# EAGLE schematic BeagleBone_Black_egl (EAGLE 6.2), part 1 of 2

## Sheet 1 of 11
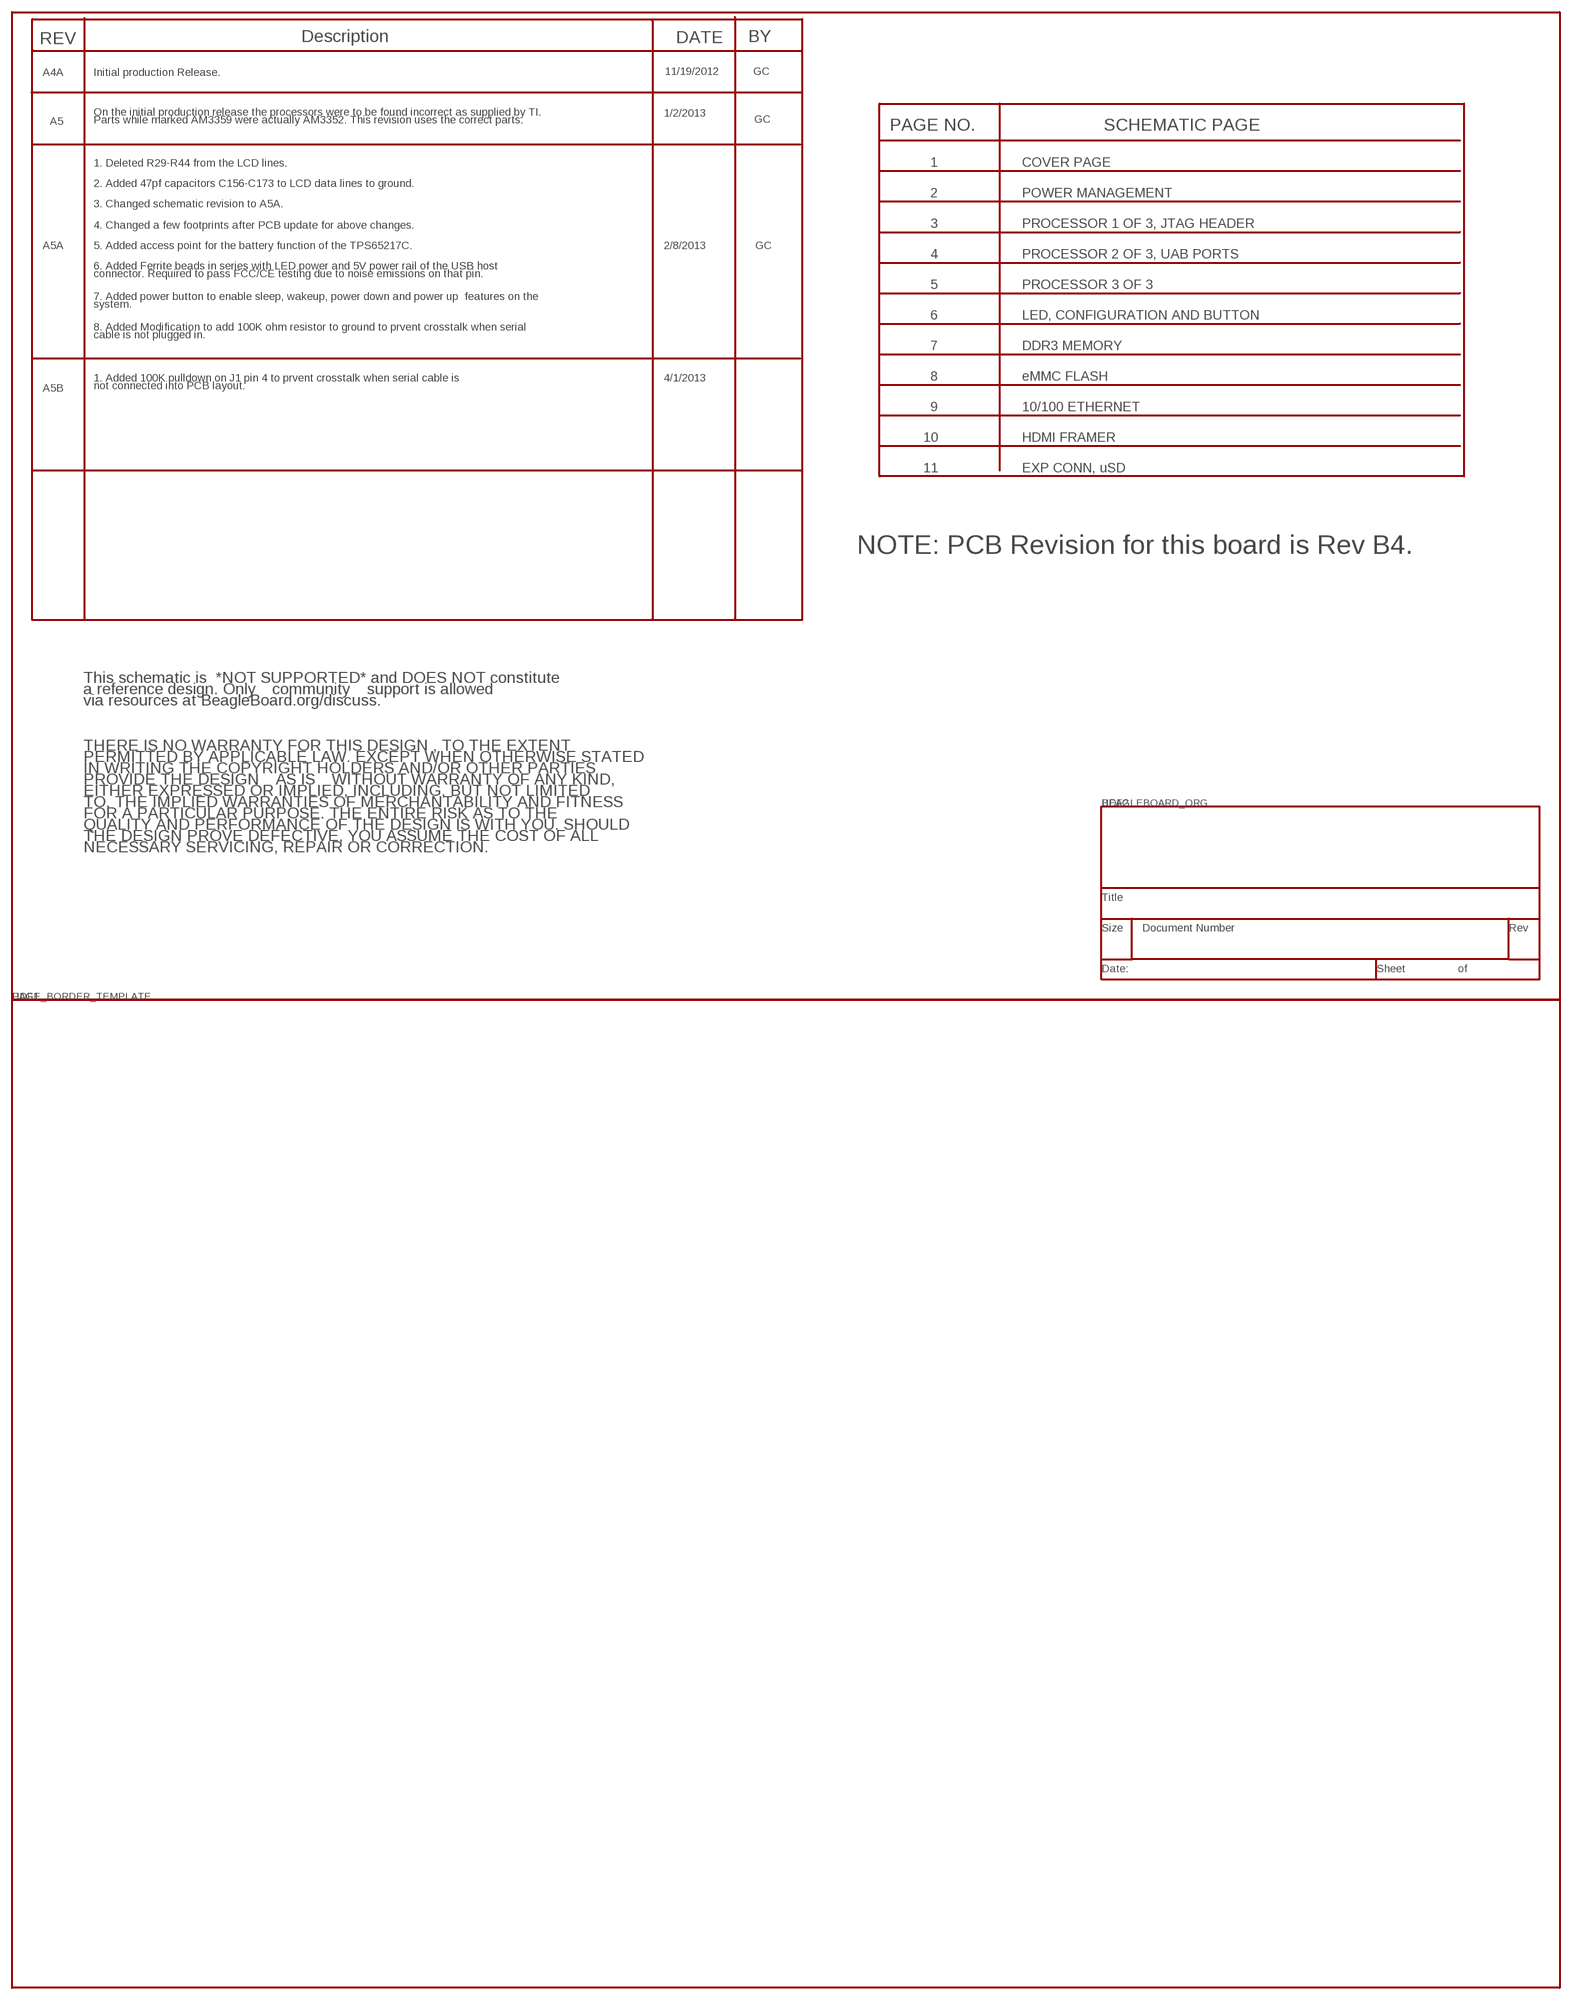
[diagram p0: schematic, sheet 1]

### Notes on the sheet
- REV | Description | DATE | BY
- A4A | Initial production Release. | 11/19/2012 | GC
- On the initial production release the processors were to be found incorrect as supplied by TI. | 1/2/2013
- A5 | Parts while marked AM3359 were actually AM3352. This revision uses the correct parts. | GC
- PAGE NO. | SCHEMATIC PAGE
- 1. Deleted R29-R44 from the LCD lines. | 1 | COVER PAGE
- 2. Added 47pf capacitors C156-C173 to LCD data lines to ground.
- 2 | POWER MANAGEMENT
- 3. Changed schematic revision to A5A.
- 4. Changed a few footprints after PCB update for above changes. | 3 | PROCESSOR 1 OF 3, JTAG HEADER
- A5A | 5. Added access point for the battery function of the TPS65217C. | 2/8/2013 | GC
- 4 | PROCESSOR 2 OF 3, UAB PORTS
- 6. Added Ferrite beads in series with LED power and 5V power rail of the USB host
- connector. Required to pass FCC/CE testing due to noise emissions on that pin.
- 5 | PROCESSOR 3 OF 3
- 7. Added power button to enable sleep, wakeup, power down and power up  features on the
- system.
- 6 | LED, CONFIGURATION AND BUTTON
- 8. Added Modification to add 100K ohm resistor to ground to prvent crosstalk when serial
- cable is not plugged in.
- 7 | DDR3 MEMORY
- 1. Added 100K pulldown on J1 pin 4 to prvent crosstalk when serial cable is | 4/1/2013 | 8 | eMMC FLASH
- A5B | not connected into PCB layout.
- 9 | 10/100 ETHERNET
- 10 | HDMI FRAMER
- 11 | EXP CONN, uSD
- NOTE: PCB Revision for this board is Rev B4.
- This schematic is  *NOT SUPPORTED* and DOES NOT constitute
- a reference design. Only community support is allowed
- via resources at BeagleBoard.org/discuss.
- THERE IS NO WARRANTY FOR THIS DESIGN , TO THE EXTENT
- PERMITTED BY APPLICABLE LAW. EXCEPT WHEN OTHERWISE STATED
- IN WRITING THE COPYRIGHT HOLDERS AND/OR OTHER PARTIES
- PROVIDE THE DESIGN AS IS WITHOUT WARRANTY OF ANY KIND,
- EITHER EXPRESSED OR IMPLIED, INCLUDING, BUT NOT LIMITED
- TO, THE IMPLIED WARRANTIES OF MERCHANTABILITY AND FITNESS
- FOR A PARTICULAR PURPOSE. THE ENTIRE RISK AS TO THE
- QUALITY AND PERFORMANCE OF THE DESIGN IS WITH YOU. SHOULD
- THE DESIGN PROVE DEFECTIVE, YOU ASSUME THE COST OF ALL
- NECESSARY SERVICING, REPAIR OR CORRECTION.

## Sheet 2 of 11
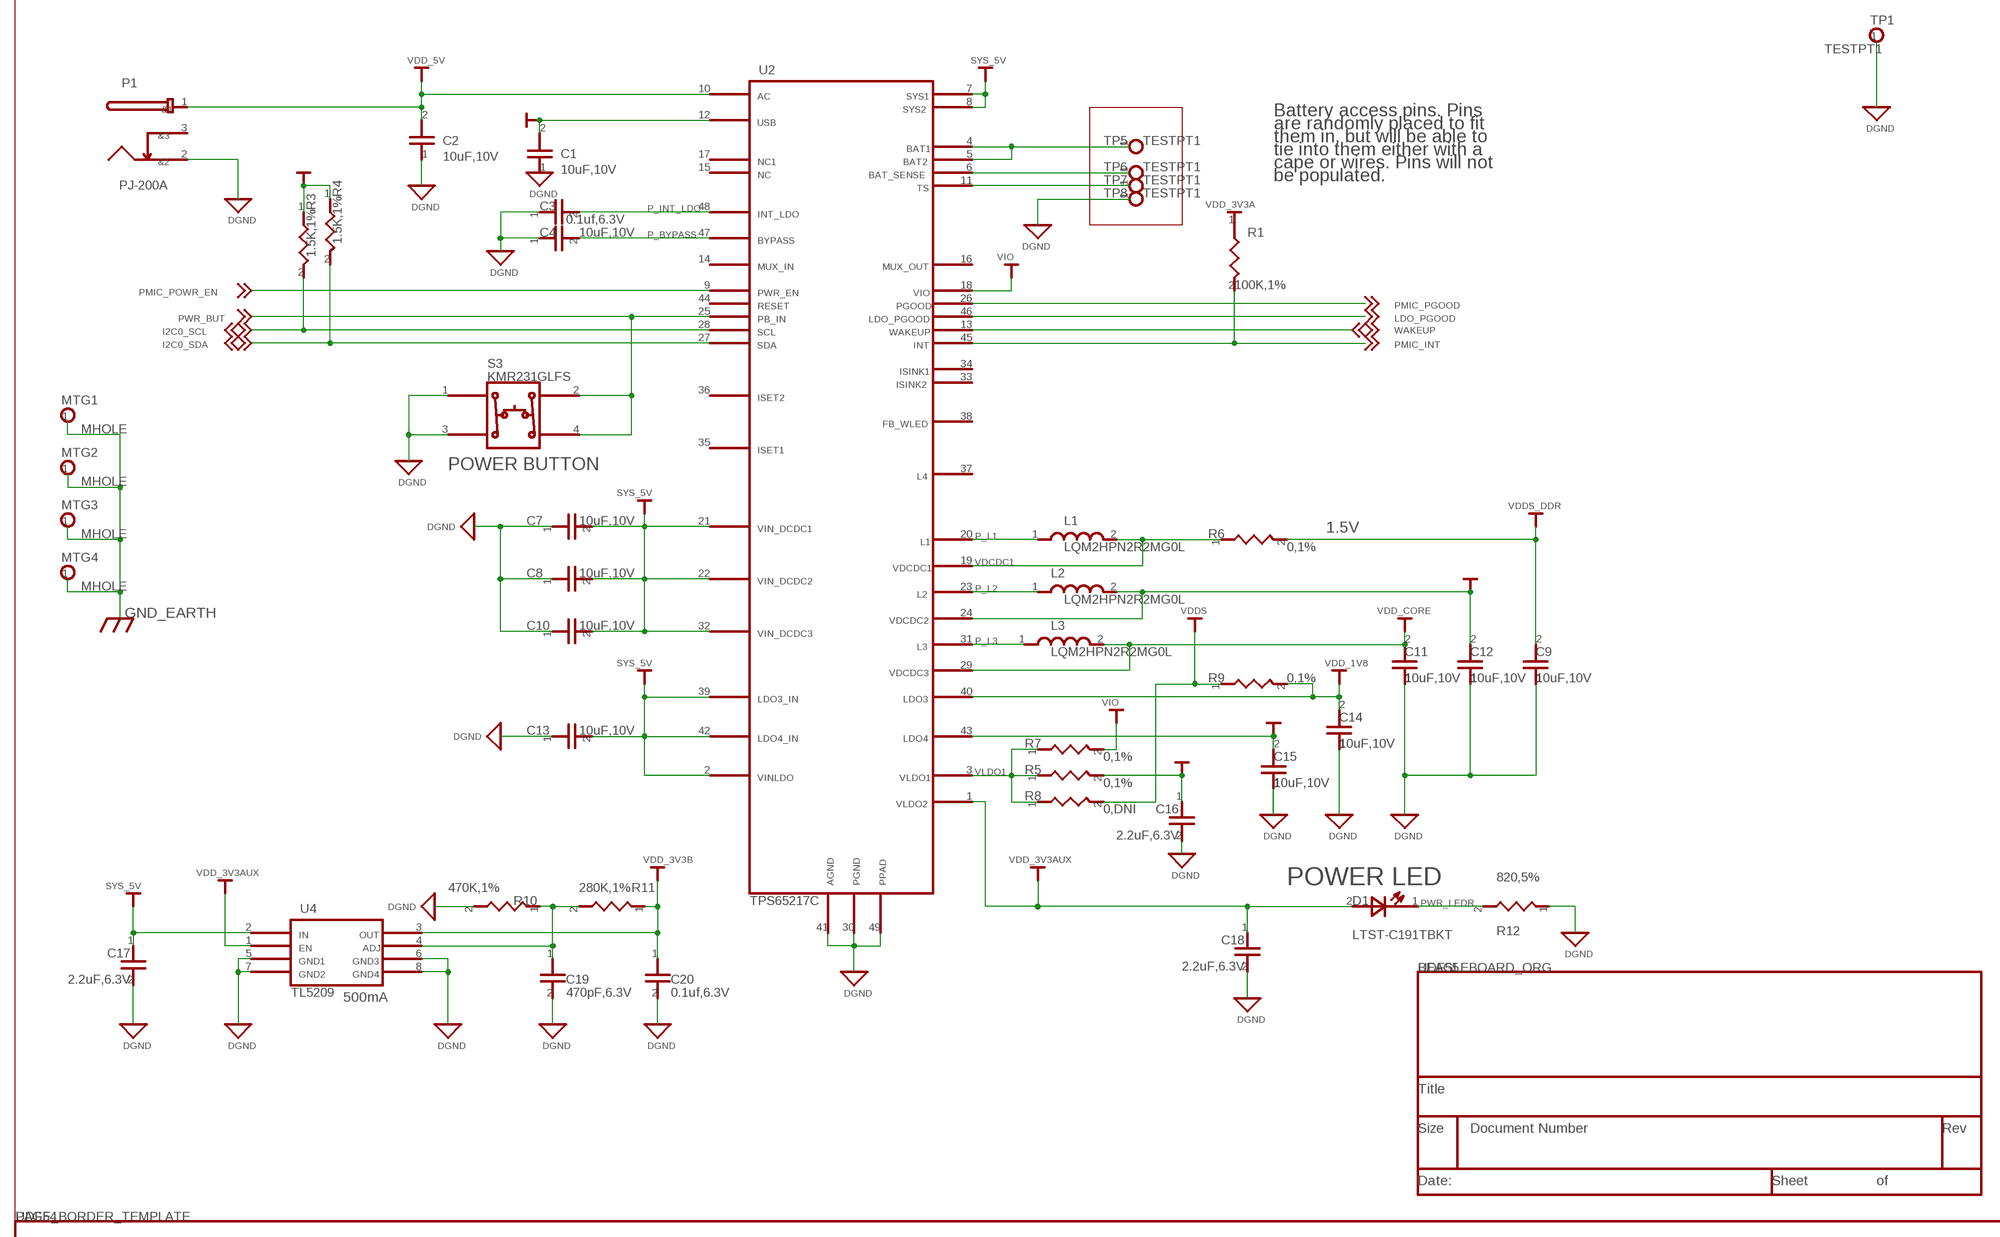
[diagram p1: schematic, sheet 2]

### Parts
C1  10uF,10V  CAP_10UF_Y5V_10V_10%_0805_805_1  [805]
C2  10uF,10V  CAP_10UF_Y5V_10V_10%_0805_805_1  [805]
C3  0.1uf,6.3V  CAP_0.1UF_X5R_6.3V_20%_0201__40  [402]
C4  10uF,10V  CAP_10UF_Y5V_10V_10%_0805_805_1  [805]
C7  10uF,10V  CAP_10UF_Y5V_10V_10%_0805_805_1  [805]
C8  10uF,10V  CAP_10UF_Y5V_10V_10%_0805_805_1  [805]
C9  10uF,10V  CAP_10UF_Y5V_10V_10%_0805_805_1  [805]
C10  10uF,10V  CAP_10UF_Y5V_10V_10%_0805_805_1  [805]
C11  10uF,10V  CAP_10UF_Y5V_10V_10%_0805_805_1  [805]
C12  10uF,10V  CAP_10UF_Y5V_10V_10%_0805_805_1  [805]
C13  10uF,10V  CAP_10UF_Y5V_10V_10%_0805_805_1  [805]
C14  10uF,10V  CAP_10UF_Y5V_10V_10%_0805_805_1  [805]
C15  10uF,10V  CAP_10UF_Y5V_10V_10%_0805_805_1  [805]
C16  2.2uF,6.3V  CAP_2.2UF_X5R_6.3V_10%_0402_402  [402]
C17  2.2uF,6.3V  CAP_2.2UF_X5R_6.3V_10%_0402_402  [402]
C18  2.2uF,6.3V  CAP_2.2UF_X5R_6.3V_10%_0402_402  [402]
C19  470pF,6.3V  CAP_470PF_X7R_25V_10%_0402_402_  [402]
C20  0.1uf,6.3V  CAP_0.1UF_X5R_6.3V_20%_0201__40  [402]
D1  LTST-C191TBKT  LED_LTST-C150GKT_0_LED_0603_DIS  [LED_0603]
L1  LQM2HPN2R2MG0L  IND_2.2UH_2.6A_10%_SMD_2520_LQM  [2520]
L2  LQM2HPN2R2MG0L  IND_2.2UH_2.6A_10%_SMD_2520_LQM  [2520]
L3  LQM2HPN2R2MG0L  IND_2.2UH_2.6A_10%_SMD_2520_LQM  [2520]
MTG1  MHOLE  MHOLE_MTGH200C125D_PL_MHOLE  [MTGH200C125D_PL]
MTG2  MHOLE  MHOLE_MTGH200C125D_PL_MHOLE  [MTGH200C125D_PL]
MTG3  MHOLE  MHOLE_MTGH200C125D_PL_MHOLE  [MTGH200C125D_PL]
MTG4  MHOLE  MHOLE_MTGH200C125D_PL_MHOLE  [MTGH200C125D_PL]
P1  PJ-200A  POWER_JACK_CONN3-PWR-PJ102A_PJ-  [CONN3-PWR-PJ102A]
R1  100K,1%  RES_100K_1/16W_1%_0402_402_100K  [402]
R3  1.5K,1%  RES_1.5K_1/16W_5%_0402_402_1.5K  [402]
R4  1.5K,1%  RES_1.5K_1/16W_5%_0402_402_1.5K  [402]
R5  0,1%  RES_4.75K_1/16W_1%_0402_402_0_1  [402]
R6  0,1%  RES_4.75K_1/16W_1%_0402_402_0_1  [402]
R7  0,1%  RES_4.75K_1/16W_1%_0402_402_0_1  [402]
R8  0,DNI  RES_4.75K_1/16W_1%_0402_402_0_D  [402]
R9  0,1%  RES_4.75K_1/16W_1%_0402_402_0_1  [402]
R10  470K,1%  RES_470_1/10W_5%_0402_402_470K_  [402]
R11  280K,1%  RES_470_1/10W_5%_0402_402_280K_  [402]
R12  820,5%  RES_470_1/10W_5%_0402_402_820_5_2  [402]
S3  KMR231GLFS  SW_KT11P2JM_2_SW4SMD_63X161LS_D  [SW4SMD_63X161LS]
TP1  TESTPT1  TESTPT1_TP1-8040  [TP1-8040]
TP5  TESTPT1  TESTPT1_TP60C33D  [TP60C33D]
TP6  TESTPT1  TESTPT1_TP60C33D  [TP60C33D]
TP7  TESTPT1  TESTPT1_TP60C33D  [TP60C33D]
TP8  TESTPT1  TESTPT1_TP60C33D  [TP60C33D]
U2  TPS65217C  PWR_TPS65217_2_U_48_RSL_TPS6521  [U_48_RSL]
U4  TL5209  PWR_TLV70233DBV_0_SO8-25X75_TL5  [SO8-25X75]

### Nets
DGND: C1.1 C2.1 C3.1 C4.1 C7.1 C8.1 C9.1 C10.1 C11.1 C12.1 C13.1 C14.1 C15.1 C16.2 C17.2 C18.2 C19.2 C20.2 P1.2 R10.2 R12.1 S3.1 S3.3 TP1.1 TP8.1 U2.30 U2.41 U2.49 U4.5 U4.6 U4.7 U4.8 ; supply symbol labelled GND_SIGNAL_DGND ; also sheet 3,4,5,6,7,8,9,10,11
GND_EARTH: MTG1.1 MTG2.1 MTG3.1 MTG4.1 ; supply symbol labelled GND_EARTH_GND_EARTH ; also sheet 4,9,10,11
I2C0_SCL: R3.2 U2.28 ; also sheet 4,10,11
I2C0_SDA: R4.2 U2.27 ; also sheet 4,10,11
LDO_PGOOD: U2.46 ; also sheet 3
N21757673: C19.1 R10.1 R11.2 U4.4
N22420400: TP5.1 U2.4 U2.5
N22420444: TP6.1 U2.6
N22420447: TP7.1 U2.11
P_BYPASS: C4.2 U2.47
P_INT_LDO: C3.2 U2.48
P_L1: L1.1 U2.20
P_L2: L2.1 U2.23
P_L3: L3.1 U2.31
PMIC_INT: R1.2 U2.45 ; also sheet 3
PMIC_PGOOD: U2.26 ; also sheet 3
PMIC_POWR_EN: U2.9 ; also sheet 4
PWR_BUT: S3.2 S3.4 U2.25 ; also sheet 11
PWR_LEDR: D1.1 R12.2
SYS_5V: C7.2 C8.2 C10.2 C13.2 C17.1 U2.2 U2.7 U2.8 U2.21 U2.22 U2.32 U2.39 U2.42 U4.2 ; supply symbol labelled VCC_BAR_SYS_5V ; also sheet 4,6,10,11
USB_DC: C1.2 U2.12 ; supply symbol labelled VBUS_5V0_USB_DC ; also sheet 4
VDCDC1: L1.2 R6.1 U2.19
VDD_1V8: C14.2 R9.2 U2.40 ; supply symbol labelled VCC_BAR_VDD_1V8 ; also sheet 5,10
VDD_3V3A: C15.2 R1.1 R3.1 R4.1 U2.43 ; supply symbol labelled VCC_BAR_VDD_3V3A ; also sheet 3,4,5,6,11
VDD_3V3AUX: C18.1 D1.2 U2.1 U4.1 ; supply symbol labelled VCC_BAR_VDD_3V3AUX
VDD_3V3B: C20.1 R11.1 U4.3 ; supply symbol labelled VCC_BAR_VDD_3V3B ; also sheet 3,4,8,9,10,11
VDD_5V: C2.2 P1.1 U2.10 ; supply symbol labelled VCC_BAR_VDD_5V ; also sheet 11
VDD_CORE: C11.2 L3.2 U2.29 ; supply symbol labelled VCC_BAR_VDD_CORE ; also sheet 5
VDD_MPU: C12.2 L2.2 U2.24 ; supply symbol labelled VCC_BAR_VDD_MPU ; also sheet 5
VDDS: R8.2 R9.1 ; supply symbol labelled VCC_BAR_VDDS ; also sheet 5
VDDS_DDR: C9.2 R6.2 ; supply symbol labelled VCC_BAR_VDDS_DDR ; also sheet 5,7
VIO: R7.2 U2.18 ; supply symbol labelled VCC_BAR_VIO
VLDO1: R5.1 R7.1 R8.1 U2.3
VRTC: C16.1 R5.2 ; supply symbol labelled VCC_BAR_VRTC ; also sheet 4,5
WAKEUP: U2.13 ; also sheet 4
Unconnected: P1.3 U2.14 U2.15 U2.16 U2.17 U2.33 U2.34 U2.35 U2.36 U2.37 U2.38 U2.44

### Notes on the sheet
- VDD_5V | SYS_5V
- Battery access pins. Pins
- are randomly placed to fit | DGND
- them in, but will be able to
- tie into them either with a
- cape or wires. Pins will not
- be populated.
- DGND
- DGND | VDD_3V3A
- P_INT_LDO
- DGND
- P_BYPASS
- DGND
- VIO
- DGND
- PMIC_POWR_EN
- PMIC_PGOOD
- PWR_BUT | LDO_PGOOD
- I2C0_SCL | WAKEUP
- I2C0_SDA | PMIC_INT
- POWER BUTTON
- DGND
- SYS_5V
- VDDS_DDR
- DGND | 1.5V
- P_L1
- VDCDC1
- P_L2
- VDDS | VDD_CORE
- GND_EARTH
- P_L3
- SYS_5V | VDD_1V8
- VIO
- DGND
- VLDO1
- DGND | DGND | DGND
- VDD_3V3B | VDD_3V3AUX
- VDD_3V3AUX | DGND
- POWER LED
- SYS_5V
- PWR_LEDR
- DGND
- DGND
- DGND
- 500mA
- DGND
- DGND | DGND | DGND | DGND | DGND

## Sheet 3 of 11
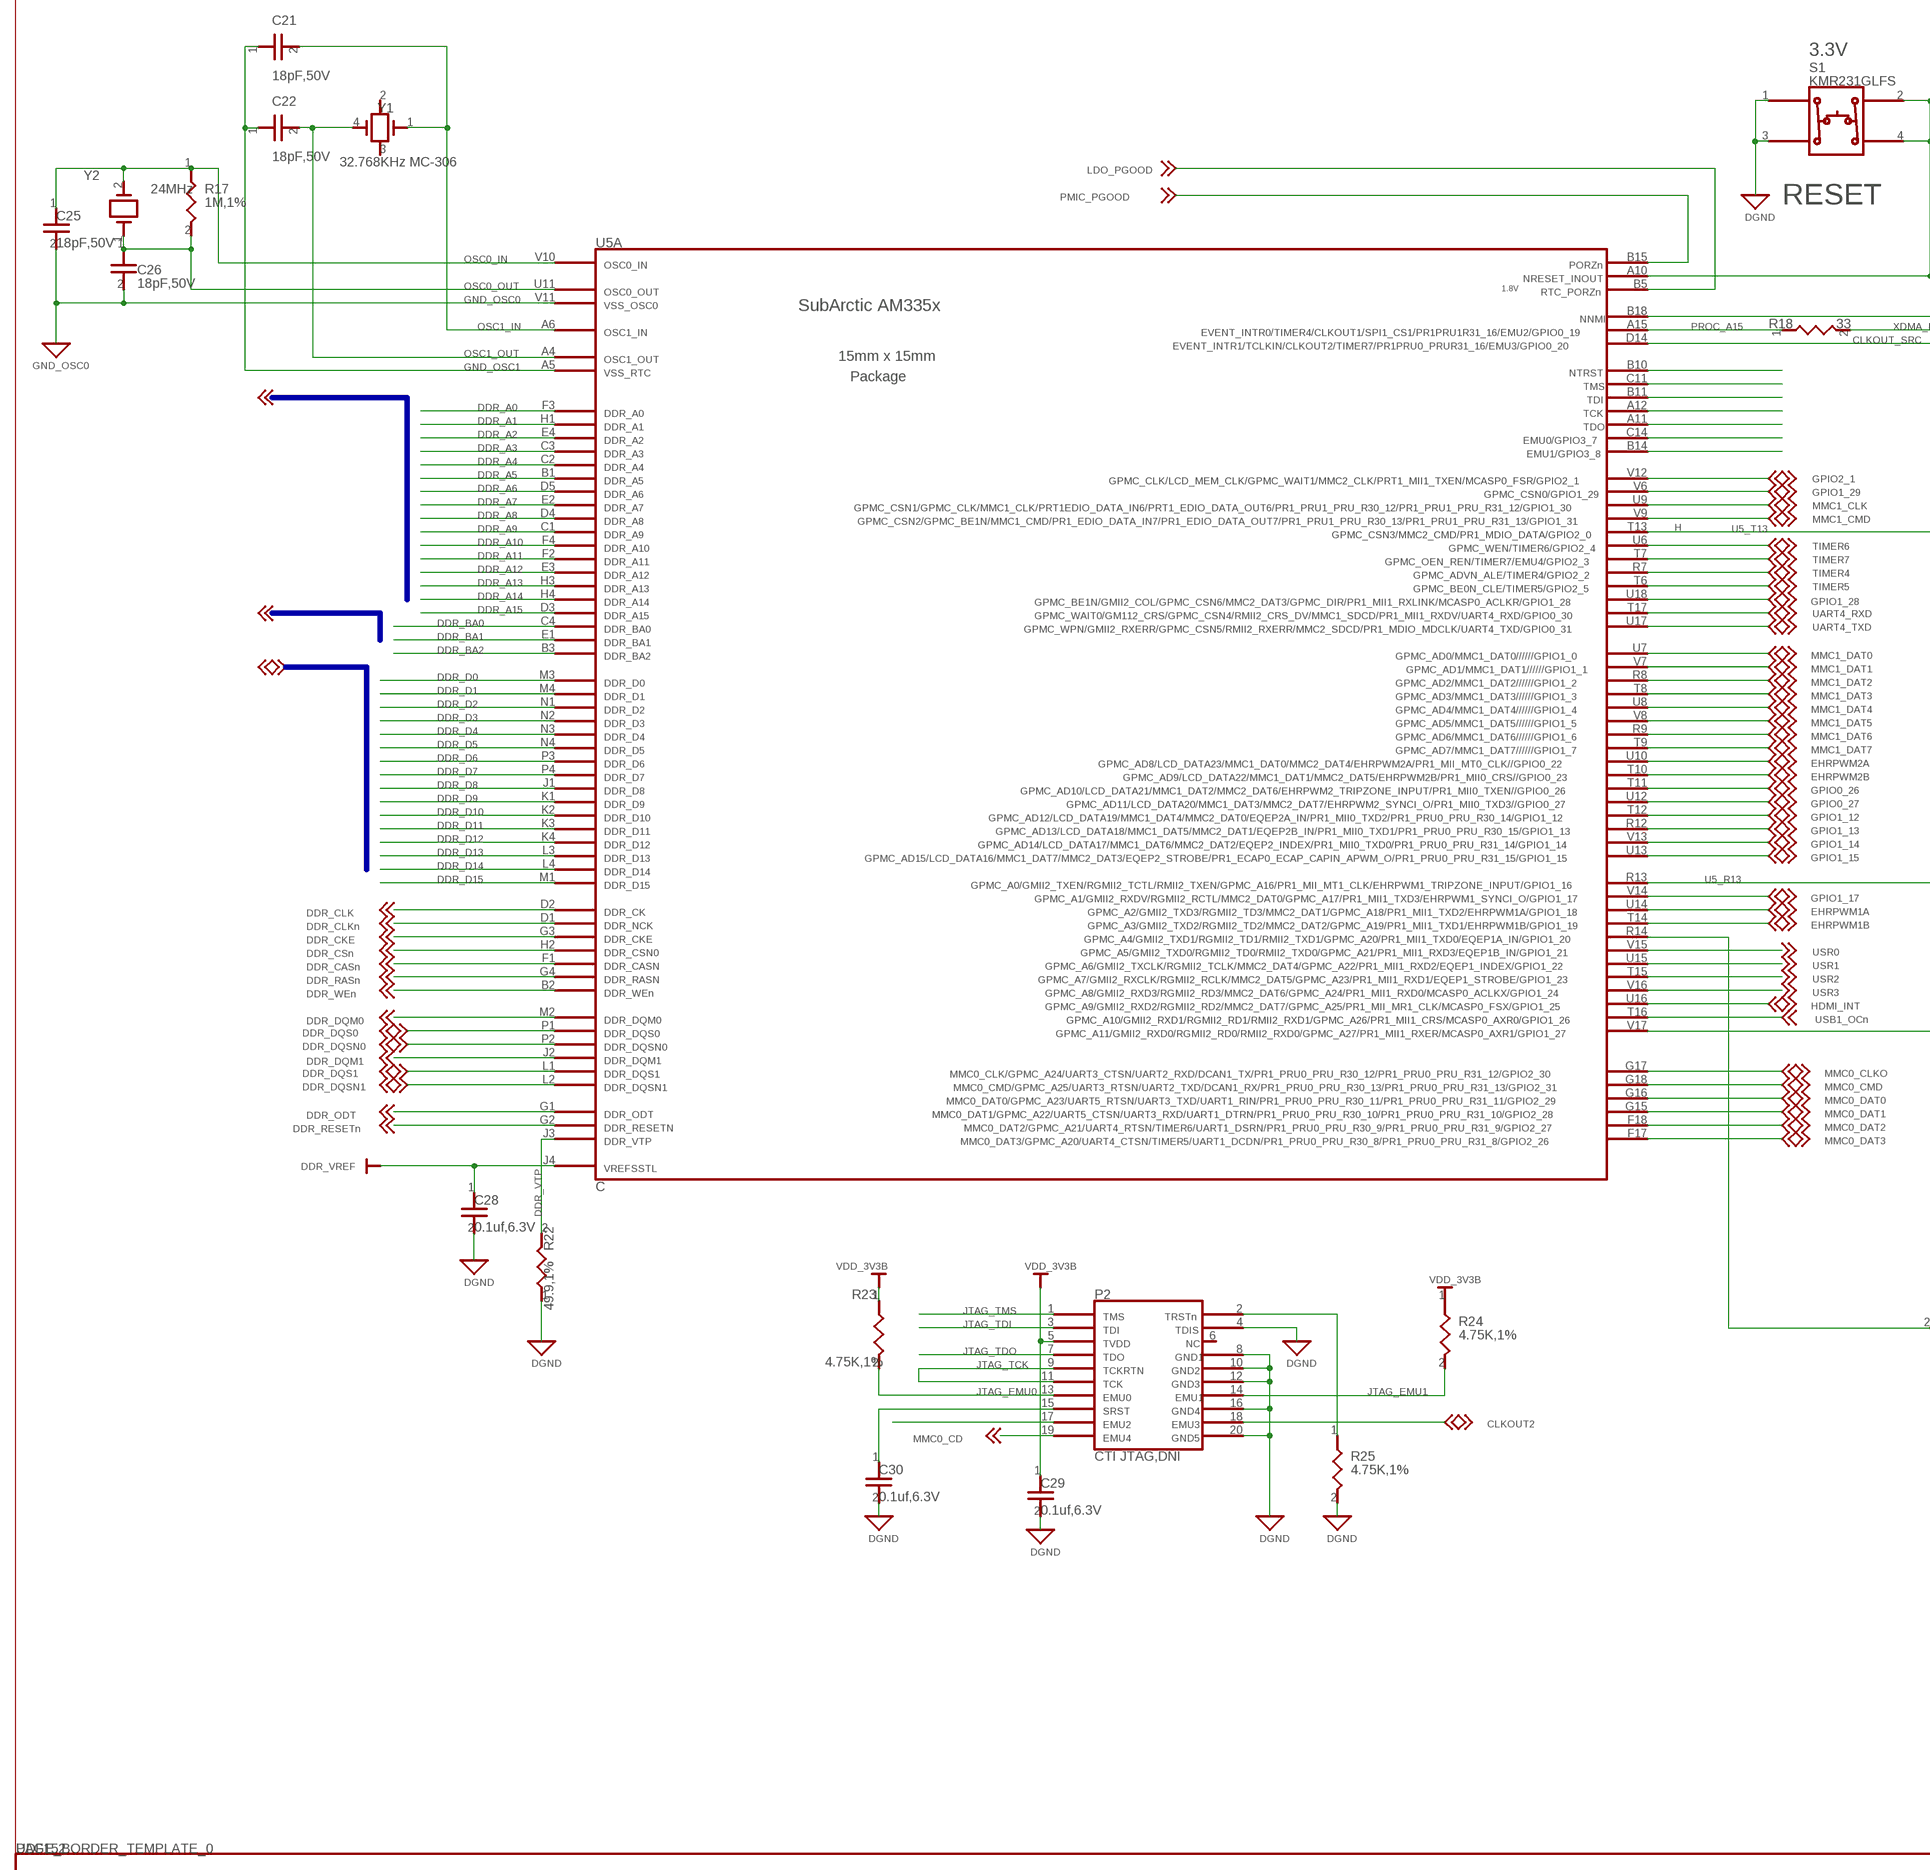
[diagram p2: schematic, sheet 3, part 1 of 2]
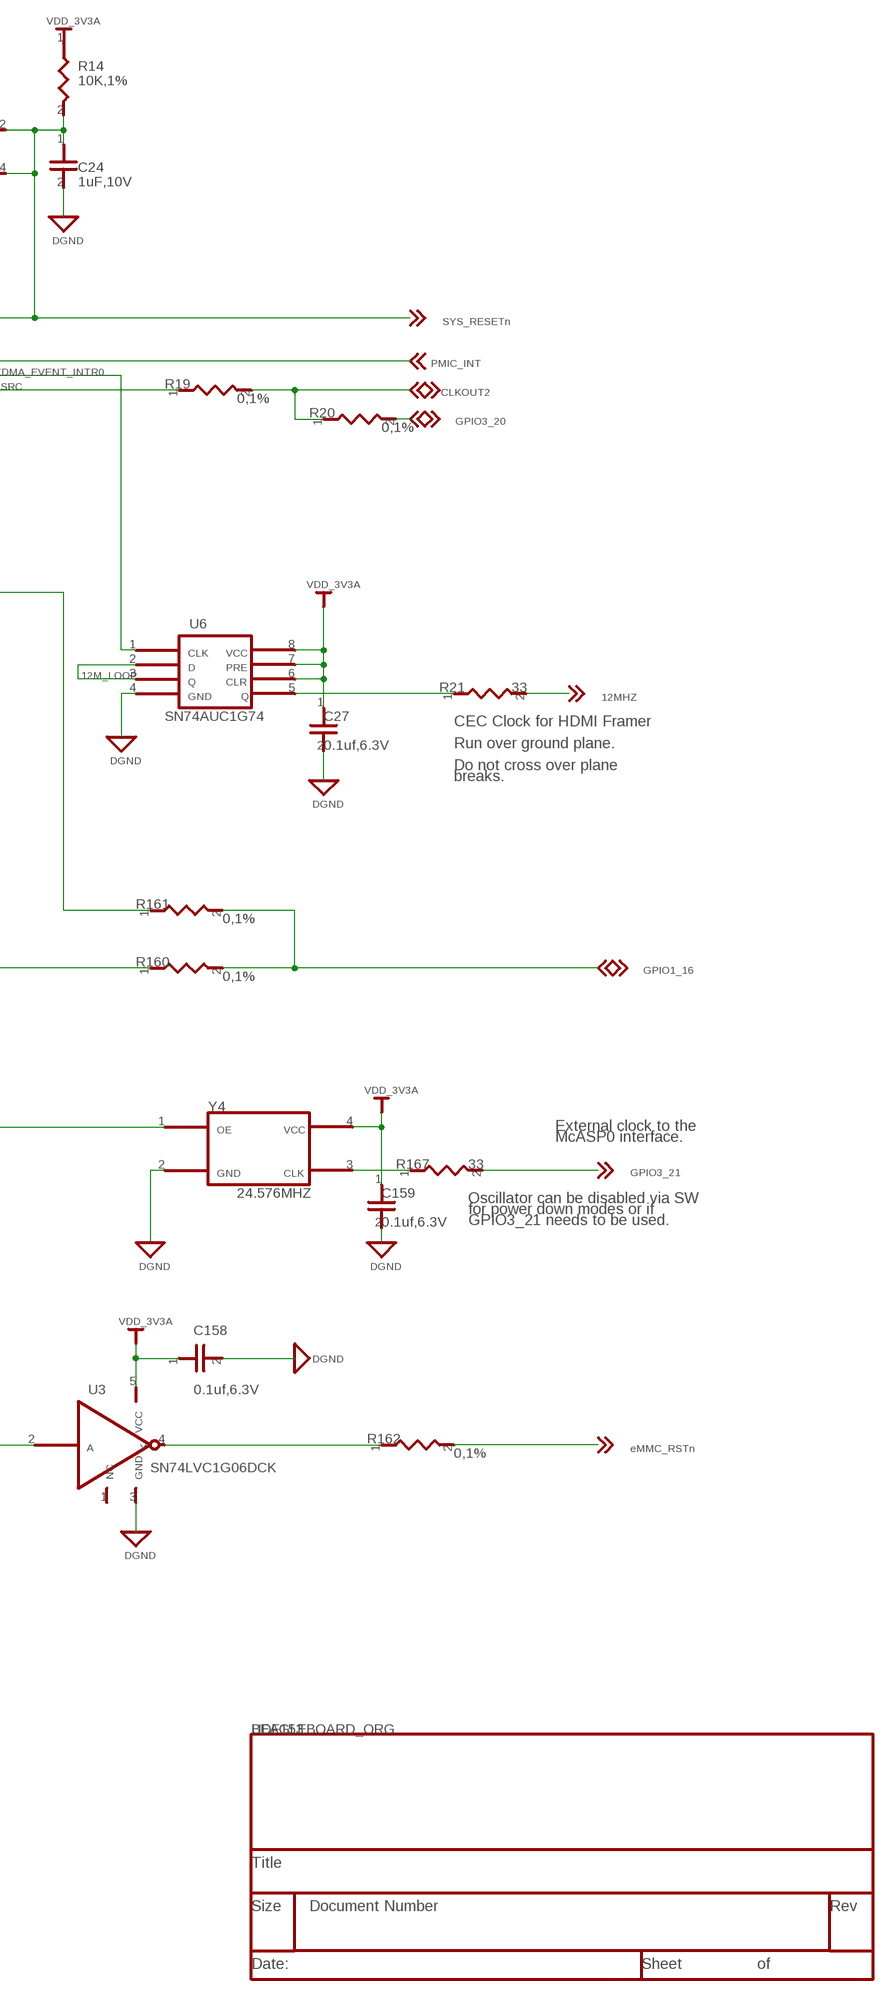
[diagram p3: schematic, sheet 3, part 2 of 2]

### Parts
C21  18pF,50V  CAP_18PF_COG_50V_5%_0402_402_18  [402]
C22  18pF,50V  CAP_18PF_COG_50V_5%_0402_402_18  [402]
C24  1uF,10V  CAP_1.0UF_X5R_10V_10%_0402_402_  [402]
C25  18pF,50V  CAP_18PF_COG_50V_5%_0402_402_18  [402]
C26  18pF,50V  CAP_18PF_COG_50V_5%_0402_402_18  [402]
C27  0.1uf,6.3V  CAP_0.1UF_X5R_6.3V_20%_0201__40  [402]
C28  0.1uf,6.3V  CAP_0.1UF_X5R_6.3V_20%_0201__40  [402]
C29  0.1uf,6.3V  CAP_0.1UF_X5R_6.3V_20%_0201__40  [402]
C30  0.1uf,6.3V  CAP_0.1UF_X5R_6.3V_20%_0201__40  [402]
C158  0.1uf,6.3V  CAP_0.1UF_X5R_6.3V_20%_0201__40  [402]
C159  0.1uf,6.3V  CAP_0.1UF_X5R_6.3V_20%_0201__40  [402]
P2  CTI JTAG,DNI  HDR_10X2_CJTAG_0_HEADER10X2_SMD  [HEADER10X2_SMD]
R14  10K,1%  RES_10K_1/16W_1%_0402_402_10K_1  [402]
R17  1M,1%  RES_1M_1/16W_1%_0402_402_1M_1%  [402]
R18  33  RES_33_0402_0402_33  [0402]
R19  0,1%  RES_0_1/16W_1%_0402_402_0_1%  [402]
R20  0,1%  RES_0_1/16W_1%_0402_402_0_1%  [402]
R21  33  RES_33_0402_0402_33  [0402]
R22  49.9,1%  RES_4.7K_0402_402_49.9_1%  [402]
R23  4.75K,1%  RES_4.75K_1/16W_1%_0402_402_4.7  [402]
R24  4.75K,1%  RES_4.75K_1/16W_1%_0402_402_4.7  [402]
R25  4.75K,1%  RES_4.75K_1/16W_1%_0402_402_4.7  [402]
R160  0,1%  RES_4.75K_1/16W_1%_0402_402_0_1  [402]
R161  0,1%  RES_4.75K_1/16W_1%_0402_402_0_1  [402]
R162  0,1%  RES_4.75K_1/16W_1%_0402_402_0_1  [402]
R167  33  RES_33_0402_0402_33  [0402]
S1  KMR231GLFS  SW_KT11P2JM_2_SW4SMD_63X161LS_D  [SW4SMD_63X161LS]
U3  SN74LVC1G06DCK  IC_SN74LVC1G06DCK_0_DCK5_2P15X1  [DCK5_2P15X1P4]
U5  C  IC_AM335X_ZCZ_AM33XX_15X15_XAM3  [AM33XX_15X15]
U6  SN74AUC1G74  IC_SN74AUC1G74_SOP8_DCT_SN74AUC  [SOP8_DCT]
Y1  32.768KHz MC-306  CRYS_32_768KHZ_SMD32_1_XTAL4_12  [XTAL4_126-216SMD]
Y2  24MHz  CRYS_24MHZ_SCC_0_XTAL150SMD_125  [XTAL150SMD_125X196]
Y4  24.576MHZ  OSC_12MHZ_1.3V_OSC4_61X65LS_79X  [OSC4_61X65LS_79X98SMD]

### Nets
12M_LOOP: U6.2 U6.3
12MHZ: R21.2 ; also sheet 10
CLKOUT2: P2.18 R19.2 R20.1 ; also sheet 11
CLKOUT_SRC: R19.1 U5.D14
DDR_A0: U5.F3 ; also sheet 7
DDR_A1: U5.H1 ; also sheet 7
DDR_A2: U5.E4 ; also sheet 7
DDR_A3: U5.C3 ; also sheet 7
DDR_A4: U5.C2 ; also sheet 7
DDR_A5: U5.B1 ; also sheet 7
DDR_A6: U5.D5 ; also sheet 7
DDR_A7: U5.E2 ; also sheet 7
DDR_A8: U5.D4 ; also sheet 7
DDR_A9: U5.C1 ; also sheet 7
DDR_A10: U5.F4 ; also sheet 7
DDR_A11: U5.F2 ; also sheet 7
DDR_A12: U5.E3 ; also sheet 7
DDR_A13: U5.H3 ; also sheet 7
DDR_A14: U5.H4 ; also sheet 7
DDR_A15: U5.D3 ; also sheet 7
DDR_BA0: U5.C4 ; also sheet 7
DDR_BA1: U5.E1 ; also sheet 7
DDR_BA2: U5.B3 ; also sheet 7
DDR_CASN: U5.F1 ; also sheet 7
DDR_CKE: U5.G3 ; also sheet 7
DDR_CLK: U5.D2 ; also sheet 7
DDR_CLKN: U5.D1 ; also sheet 7
DDR_CSN: U5.H2 ; also sheet 7
DDR_D0: U5.M3 ; also sheet 7
DDR_D1: U5.M4 ; also sheet 7
DDR_D2: U5.N1 ; also sheet 7
DDR_D3: U5.N2 ; also sheet 7
DDR_D4: U5.N3 ; also sheet 7
DDR_D5: U5.N4 ; also sheet 7
DDR_D6: U5.P3 ; also sheet 7
DDR_D7: U5.P4 ; also sheet 7
DDR_D8: U5.J1 ; also sheet 7
DDR_D9: U5.K1 ; also sheet 7
DDR_D10: U5.K2 ; also sheet 7
DDR_D11: U5.K3 ; also sheet 7
DDR_D12: U5.K4 ; also sheet 7
DDR_D13: U5.L3 ; also sheet 7
DDR_D14: U5.L4 ; also sheet 7
DDR_D15: U5.M1 ; also sheet 7
DDR_DQM0: U5.M2 ; also sheet 7
DDR_DQM1: U5.J2 ; also sheet 7
DDR_DQS0: U5.P1 ; also sheet 7
DDR_DQS1: U5.L1 ; also sheet 7
DDR_DQSN0: U5.P2 ; also sheet 7
DDR_DQSN1: U5.L2 ; also sheet 7
DDR_ODT: U5.G1 ; also sheet 7
DDR_RASN: U5.G4 ; also sheet 7
DDR_RESETN: U5.G2 ; also sheet 7
DDR_VREF: C28.1 U5.J4 ; supply symbol labelled VDD_1V8_DDR_VREF ; also sheet 7
DDR_VTP: R22.2 U5.J3
DDR_WEN: U5.B2 ; also sheet 7
DGND: C24.2 C27.2 C28.2 C29.2 C30.2 C158.2 C159.2 P2.4 P2.8 P2.10 P2.12 P2.16 P2.20 R22.1 R25.2 S1.1 S1.3 U3.3 U6.4 Y4.2 ; supply symbol labelled GND_SIGNAL_DGND ; also sheet 2,4,5,6,7,8,9,10,11
EHRPWM1A: U5.U14 ; also sheet 11
EHRPWM1B: U5.T14 ; also sheet 11
EHRPWM2A: U5.U10 ; also sheet 11
EHRPWM2B: U5.T10 ; also sheet 11
EMMC_RSTN: R162.2 ; also sheet 8
GND_OSC0: C25.2 C26.2 U5.V11 ; supply symbol labelled GND_SIGNAL_GND_OSC0
GND_OSC1: C21.1 C22.1 U5.A5
GPIO0_26: U5.T11 ; also sheet 11
GPIO0_27: U5.U12 ; also sheet 11
GPIO1_12: U5.T12 ; also sheet 11
GPIO1_13: U5.R12 ; also sheet 11
GPIO1_14: U5.V13 ; also sheet 11
GPIO1_15: U5.U13 ; also sheet 11
GPIO1_16: R160.2 R161.2 ; also sheet 11
GPIO1_17: U5.V14 ; also sheet 11
GPIO1_28: U5.U18 ; also sheet 11
GPIO1_29: U5.V6 ; also sheet 11
GPIO2_1: U5.V12 ; also sheet 11
GPIO3_20: R20.2 ; also sheet 4
GPIO3_21: R167.2 ; also sheet 4,11
HDMI_INT: U5.U16 ; also sheet 10
HDMICLK_DISN: U5.V17 Y4.1
JTAG_EMU0: P2.13 R23.2 U5.C14
JTAG_EMU1: P2.14 R24.2 U5.B14
JTAG_TCK: P2.9 P2.11 U5.A12
JTAG_TDI: P2.3 U5.B11
JTAG_TDO: P2.7 U5.A11
JTAG_TMS: P2.1 U5.C11
JTAG_TRSTN: P2.2 R25.1 U5.B10
LDO_PGOOD: U5.B5 ; also sheet 2
MMC0_CD: P2.19 ; also sheet 4,11
MMC0_CLKO: U5.G17 ; also sheet 11
MMC0_CMD: U5.G18 ; also sheet 11
MMC0_DAT0: U5.G16 ; also sheet 11
MMC0_DAT1: U5.G15 ; also sheet 11
MMC0_DAT2: U5.F18 ; also sheet 11
MMC0_DAT3: U5.F17 ; also sheet 11
MMC1_CLK: U5.U9 ; also sheet 8,11
MMC1_CMD: U5.V9 ; also sheet 8,11
MMC1_DAT0: U5.U7 ; also sheet 8,11
MMC1_DAT1: U5.V7 ; also sheet 8,11
MMC1_DAT2: U5.R8 ; also sheet 8,11
MMC1_DAT3: U5.T8 ; also sheet 8,11
MMC1_DAT4: U5.U8 ; also sheet 8,11
MMC1_DAT5: U5.V8 ; also sheet 8,11
MMC1_DAT6: U5.R9 ; also sheet 8,11
MMC1_DAT7: U5.T9 ; also sheet 8,11
N22248684: R167.1 Y4.3
N22248838: R21.1 U6.5
N22287501: R162.1 U3.4
N22287555: U3.2 U5.R14
OSC0_IN: C25.1 R17.1 U5.V10 Y2.2
OSC0_OUT: C26.1 R17.2 U5.U11 Y2.1
OSC1_IN: C21.2 U5.A6 Y1.1
OSC1_OUT: C22.2 U5.A4 Y1.4
PMIC_INT: U5.B18 ; also sheet 2
PMIC_PGOOD: U5.B15 ; also sheet 2
PROC_A15: R18.1 U5.A15
SYS_RESETN: C24.1 C30.1 P2.15 R14.2 S1.2 S1.4 U5.A10 ; also sheet 9,11
TIMER4: U5.R7 ; also sheet 11
TIMER5: U5.T6 ; also sheet 11
TIMER6: U5.U6 ; also sheet 11
TIMER7: U5.T7 ; also sheet 11
U5_R13: R160.1 U5.R13
U5_T13: R161.1 U5.T13
UART4_RXD: U5.T17 ; also sheet 11
UART4_TXD: U5.U17 ; also sheet 11
USB1_OCN: U5.T16 ; also sheet 4
USR0: U5.V15 ; also sheet 6
USR1: U5.U15 ; also sheet 6
USR2: U5.T15 ; also sheet 6
USR3: U5.V16 ; also sheet 6
VDD_3V3A: C27.1 C158.1 C159.1 R14.1 U3.5 U6.6 U6.7 U6.8 Y4.4 ; supply symbol labelled VCC_BAR_VDD_3V3A ; also sheet 2,4,5,6,11
VDD_3V3B: C29.1 P2.5 R23.1 R24.1 ; supply symbol labelled VCC_BAR_VDD_3V3B ; also sheet 2,4,8,9,10,11
XDMA_EVENT_INTR0: P2.17 R18.2 U6.1
Unconnected: P2.6 U3.1 Y1.2 Y1.3

### Buses
BUS0
BUS1
BUS2

### Notes on the sheet
- VDD_3V3A
- 3.3V
- LDO_PGOOD
- PMIC_PGOOD
- RESET | DGND
- DGND
- OSC0_IN
- SYS_RESETn
- OSC0_OUT
- GND_OSC0
- PMIC_INT
- OSC1_IN | PROC_A15 | XDMA_EVENT_INTR0
- CLKOUT_SRC
- CLKOUT2
- OSC1_OUT
- GND_OSC0 | GND_OSC1
- GPIO3_20
- DDR_A0
- DDR_A1
- DDR_A2
- DDR_A3
- DDR_A4
- DDR_A5
- GPIO2_1
- DDR_A6
- GPIO1_29
- DDR_A7
- MMC1_CLK
- DDR_A8
- MMC1_CMD
- H | VDD_3V3A
- DDR_A9 | U5_T13
- DDR_A10
- TIMER6
- DDR_A11
- TIMER7
- DDR_A12
- TIMER4
- DDR_A13
- TIMER5
- DDR_A14
- GPIO1_28
- DDR_A15 | 12M_LOOP
- UART4_RXD
- DDR_BA0
- UART4_TXD | 12MHZ
- DDR_BA1
- DDR_BA2
- MMC1_DAT0 | CEC Clock for HDMI Framer
- MMC1_DAT1
- DDR_D0 | Run over ground plane.
- MMC1_DAT2
- DDR_D1 | DGND
- MMC1_DAT3 | Do not cross over plane
- DDR_D2 | breaks.
- MMC1_DAT4
- DDR_D3
- MMC1_DAT5
- DDR_D4 | DGND
- MMC1_DAT6
- DDR_D5
- MMC1_DAT7
- DDR_D6
- EHRPWM2A
- DDR_D7
- EHRPWM2B
- DDR_D8
- GPIO0_26
- DDR_D9
- GPIO0_27
- DDR_D10
- GPIO1_12
- DDR_D11
- GPIO1_13
- DDR_D12
- GPIO1_14
- DDR_D13
- GPIO1_15
- DDR_D14
- DDR_D15 | U5_R13
- GPIO1_16
- GPIO1_17
- DDR_CLK | EHRPWM1A
- DDR_CLKn | EHRPWM1B
- DDR_CKE
- DDR_CSn | USR0
- DDR_CASn | USR1
- DDR_RASn | USR2
- DDR_WEn | USR3
- VDD_3V3A
- HDMI_INT
- DDR_DQM0 | USB1_OCn
- DDR_DQS0 | External clock to the
- McASP0 interface.
- DDR_DQSN0
- DDR_DQM1
- DDR_DQS1 | MMC0_CLKO | GPIO3_21
- DDR_DQSN1 | MMC0_CMD
- MMC0_DAT0 | Oscillator can be disabled via SW
- for power down modes or if
- DDR_ODT | MMC0_DAT1
- GPIO3_21 needs to be used.
- DDR_RESETn | MMC0_DAT2
- MMC0_DAT3
- DGND | DGND
- DDR_VREF
- VDD_3V3A
- DDR_VTP
- DGND
- VDD_3V3B | VDD_3V3B
- DGND | VDD_3V3B
- JTAG_TMS
- JTAG_TDI
- eMMC_RSTn
- JTAG_TDO
- DGND | JTAG_TCK | DGND
- JTAG_EMU0 | JTAG_EMU1
- CLKOUT2
- DGND
- MMC0_CD
- DGND | DGND | DGND
- DGND

## Sheet 4 of 11
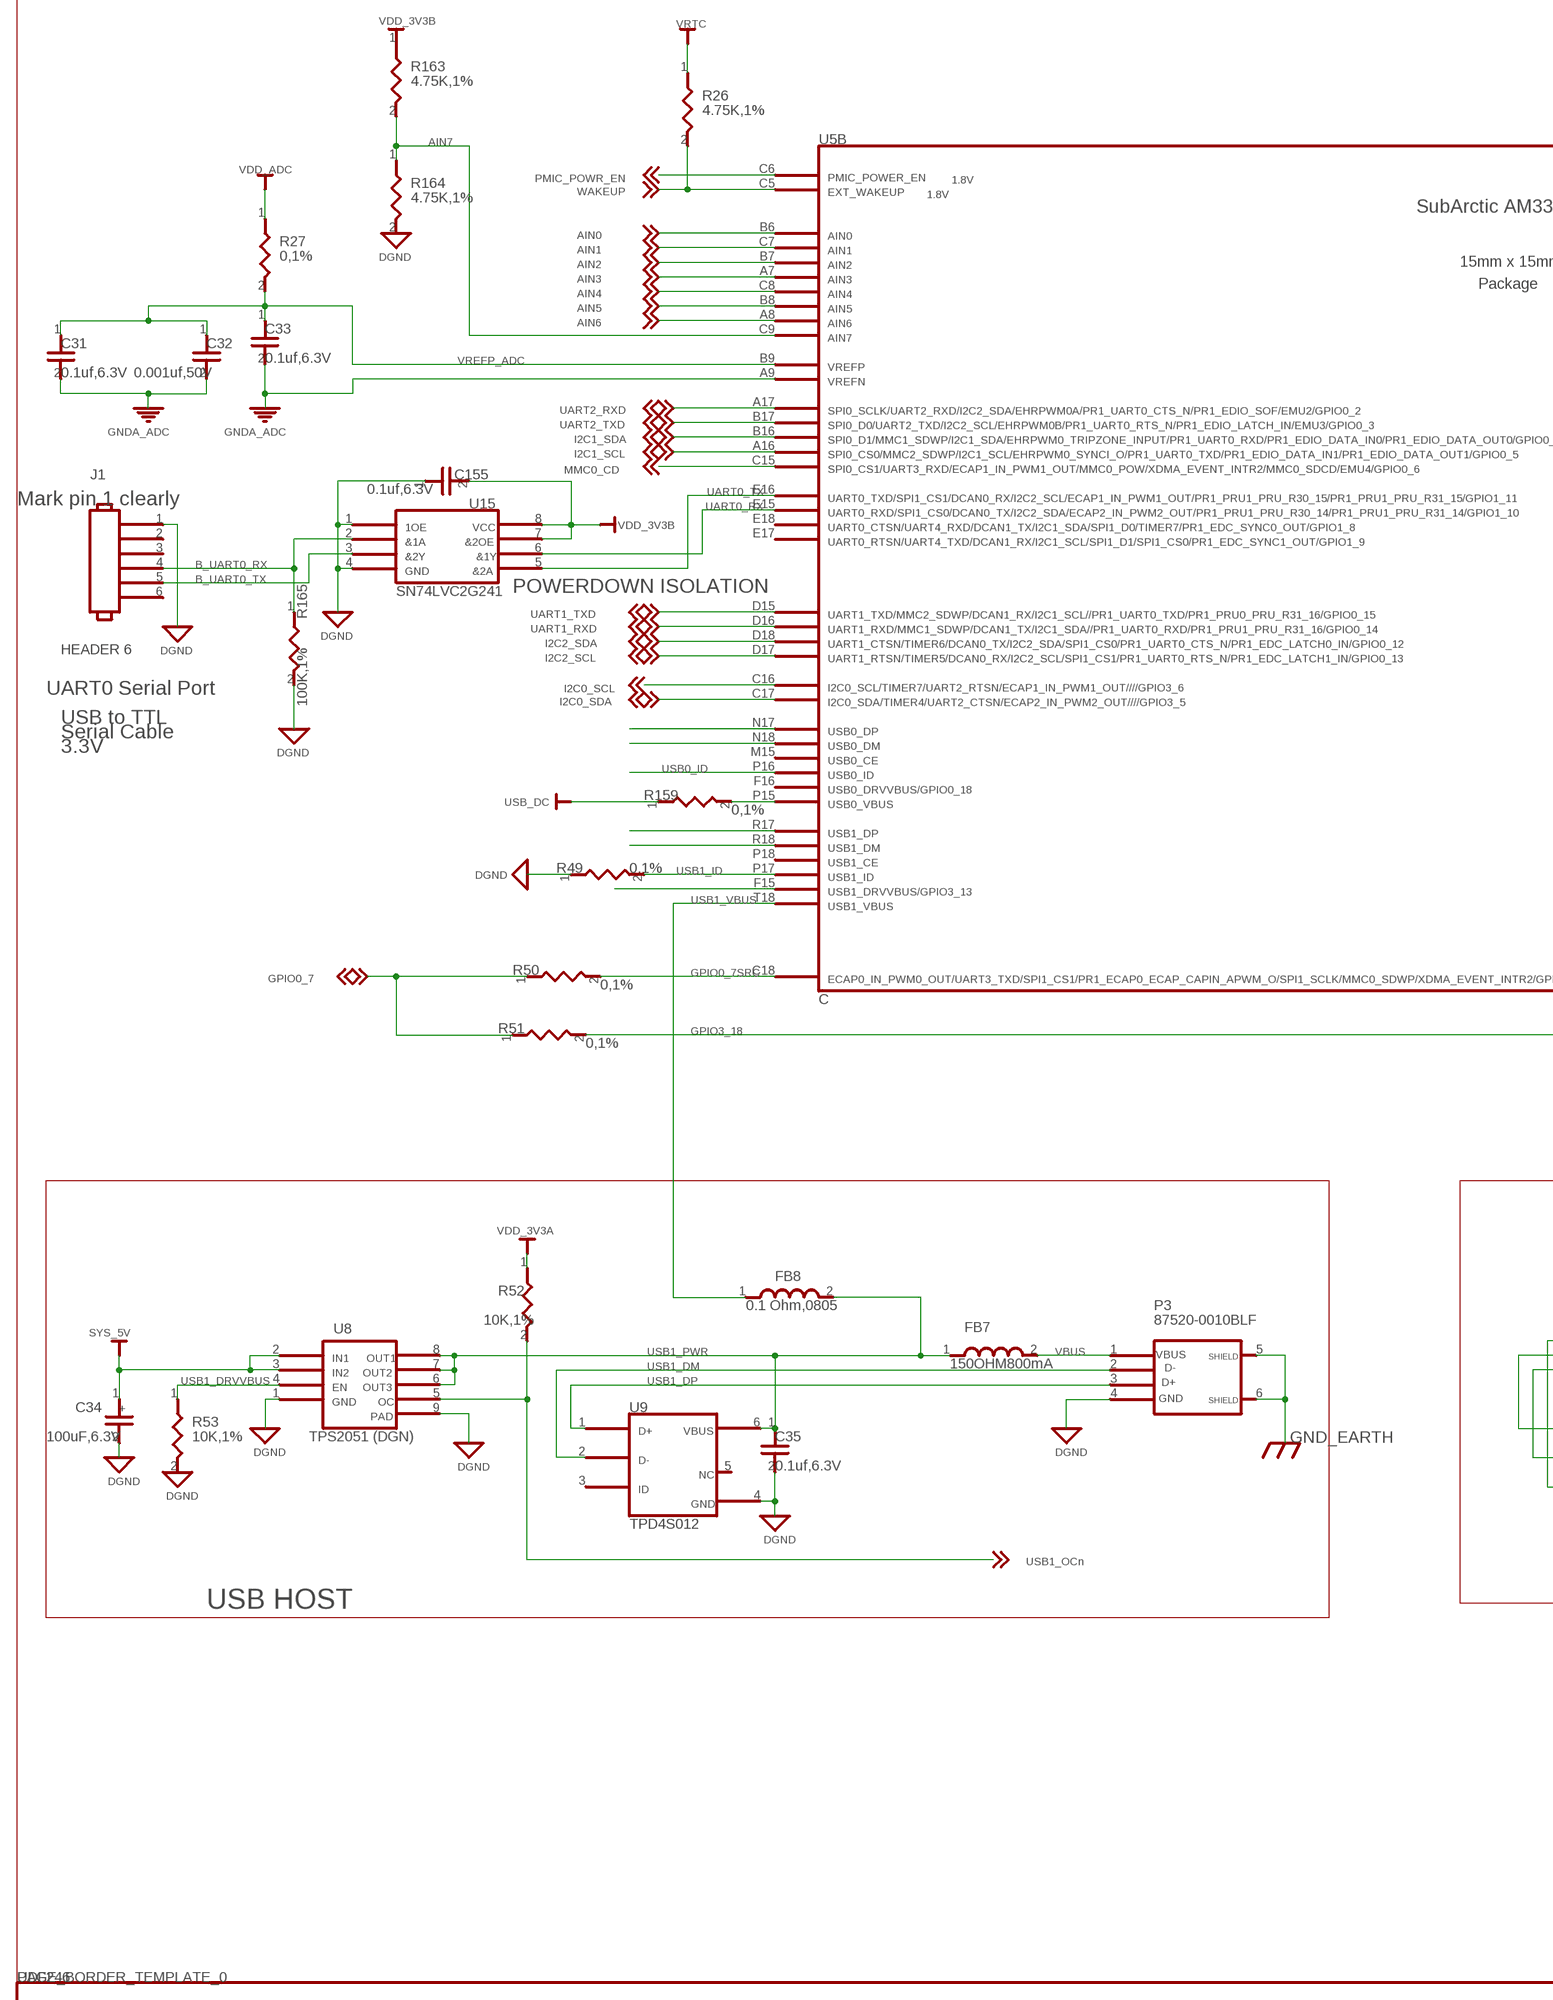
[diagram p4: schematic, sheet 4, part 1 of 2]
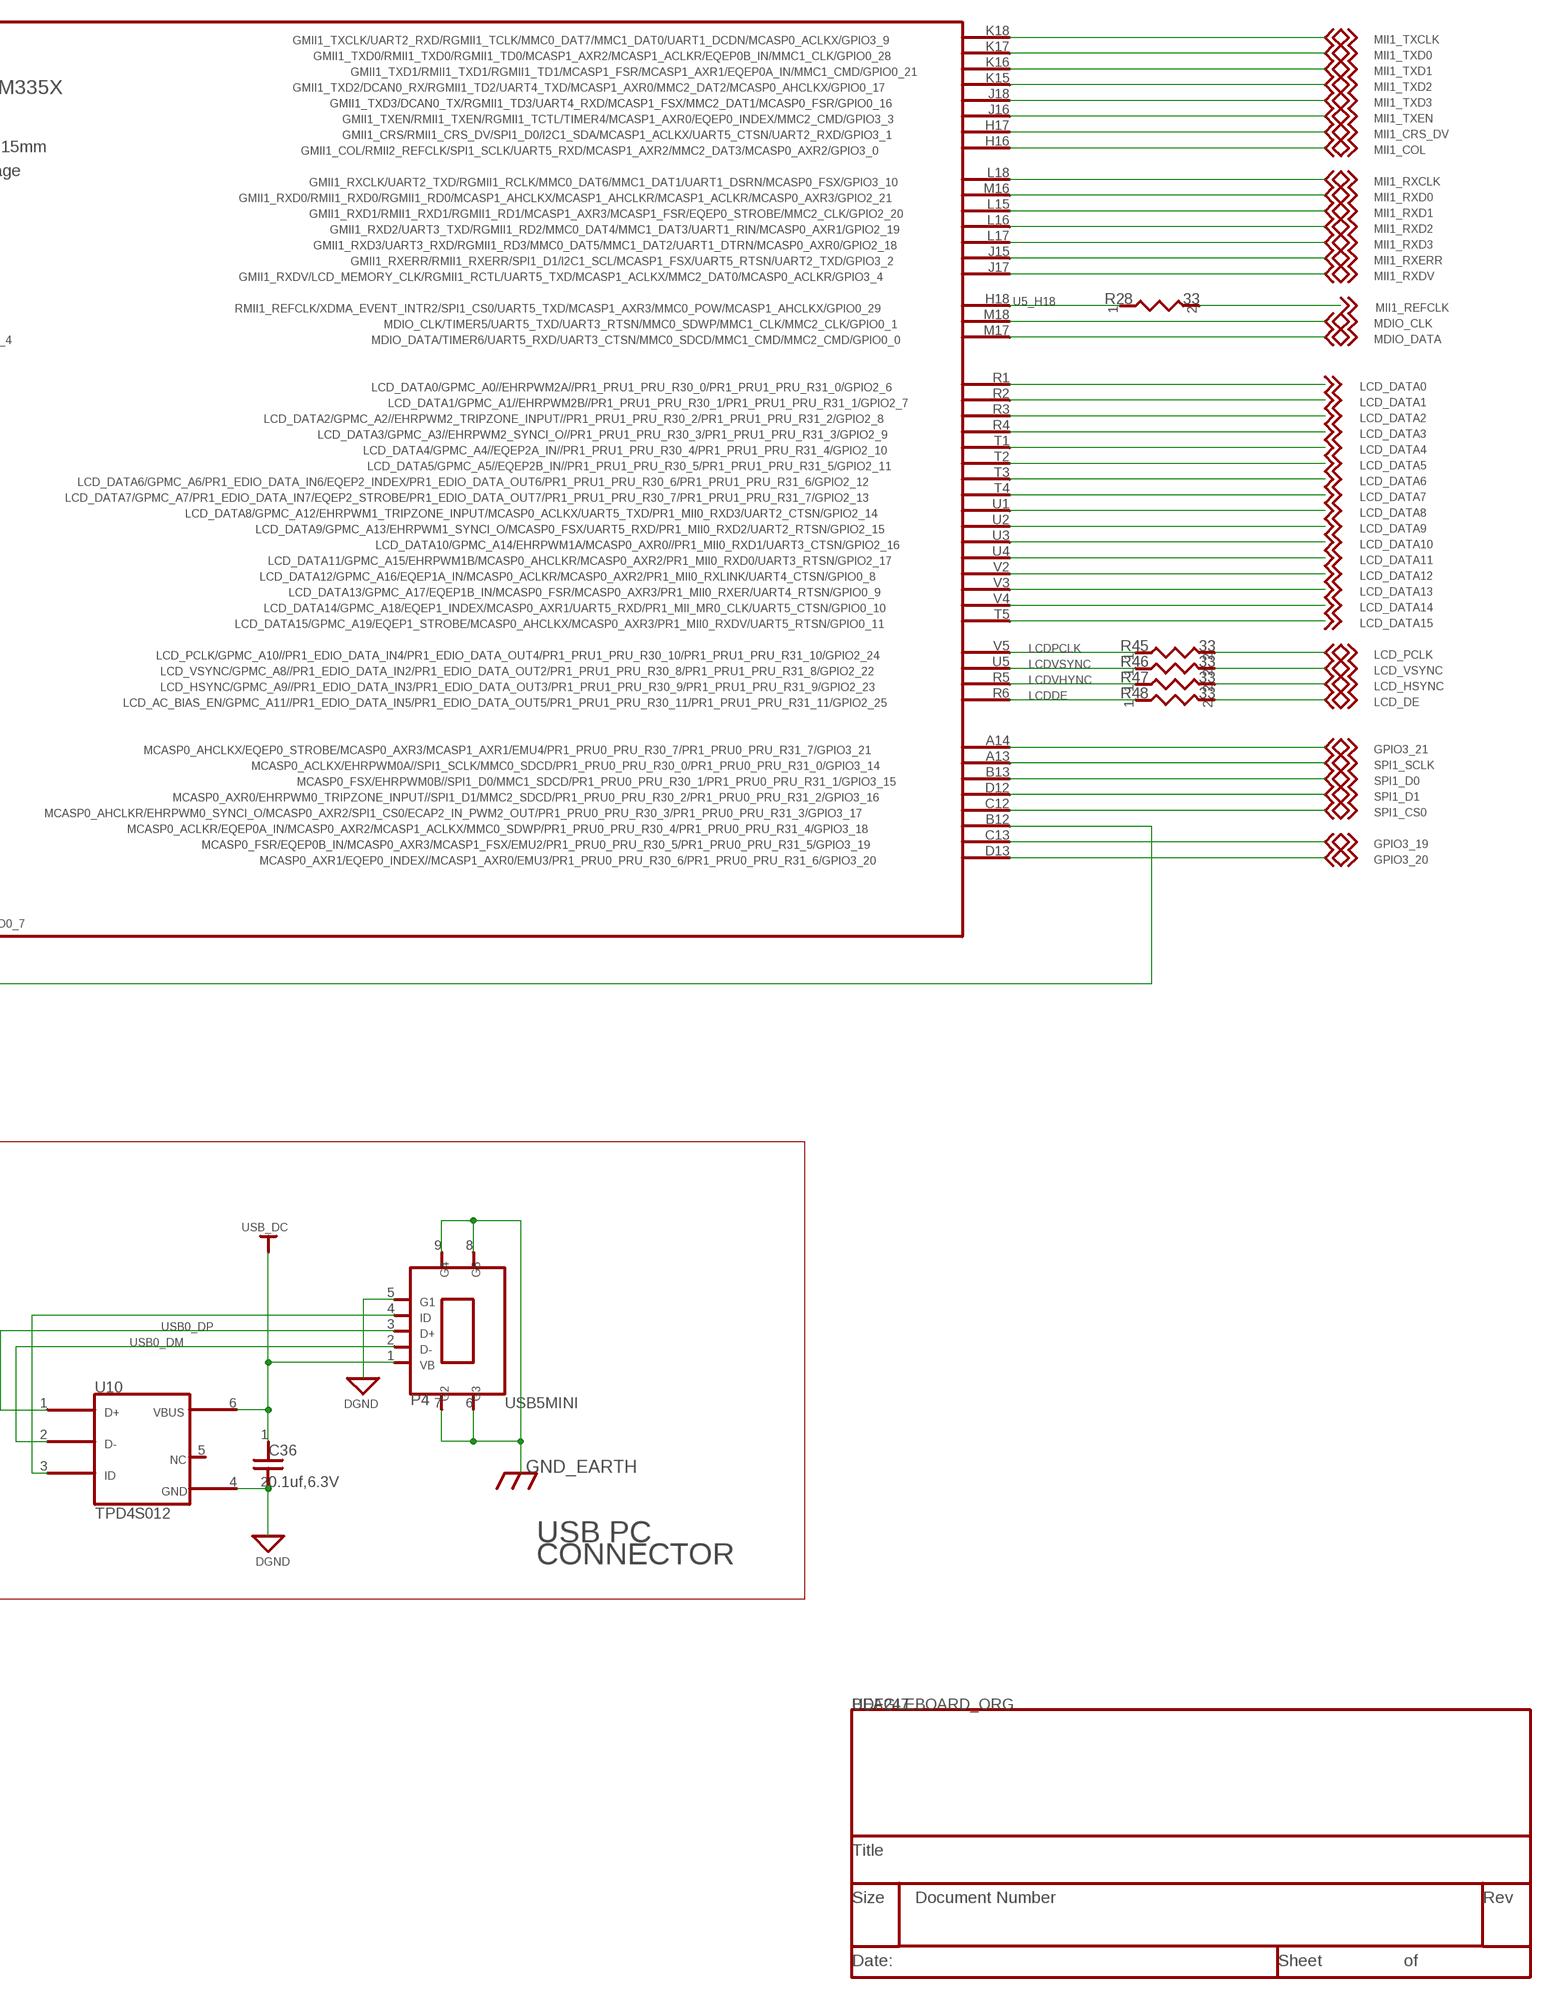
[diagram p5: schematic, sheet 4, part 2 of 2]

### Parts
C31  0.1uf,6.3V  CAP_0.1UF_X5R_6.3V_20%_0201__40  [402]
C32  0.001uf,50V  CAP_0.001_X7R_50V_5%_0402_402_0  [402]
C33  0.1uf,6.3V  CAP_0.1UF_X5R_6.3V_20%_0201__40  [402]
C34  100uF,6.3V  CAP_100UF_TANT_6.3V_3528-21_RD2  [RD205SMD_250D]
C35  0.1uf,6.3V  CAP_0.1UF_X5R_6.3V_20%_0201__40  [402]
C36  0.1uf,6.3V  CAP_0.1UF_X5R_6.3V_20%_0201__40  [402]
C155  0.1uf,6.3V  CAP_0.1UF_X5R_6.3V_20%_0201__40  [402]
FB7  150OHM800mA  FER_180_200_0_SM-7351-IND-0805_  [SM-7351-IND-0805]
FB8  0.1 Ohm,0805  FER_180_200_0_SM-7351-IND-080_1  [SM-7351-IND-0805]
J1  HEADER 6  HEADER_6_SIP6_HEADER_6  [SIP6]
P3  87520-0010BLF  CONN_54819-0578_2_USB_A_SH_IO_8  [USB_A_SH]
P4  USB5MINI  MINI-USB-AB-SOCKET_USB5MINI_4SH  [USB5MINI_4SHIELDED_SMD-5]
R26  4.75K,1%  RES_4.75K_1/16W_1%_0402_402_4.7  [402]
R27  0,1%  RES_0_1/16W_1%_0402_402_0_1%  [402]
R28  33  RES_33_0402_0402_33  [0402]
R45  33  RES_33_0402_0402_33  [0402]
R46  33  RES_33_0402_0402_33  [0402]
R47  33  RES_33_0402_0402_33  [0402]
R48  33  RES_33_0402_0402_33  [0402]
R49  0,1%  RES_100K_1/16W_1%_0402_402_0_1%  [402]
R50  0,1%  RES_4.75K_1/16W_1%_0402_402_0_1  [402]
R51  0,1%  RES_4.75K_1/16W_1%_0402_402_0_1  [402]
R52  10K,1%  RES_10K_1/16W_1%_0402_402_10K_1  [402]
R53  10K,1%  RES_10K_1/16W_1%_0402_402_10K_1  [402]
R159  0,1%  RES_4.75K_1/16W_1%_0402_402_0_1  [402]
R163  4.75K,1%  RES_4.75K_1/16W_1%_0402_402_4.7  [402]
R164  4.75K,1%  RES_4.75K_1/16W_1%_0402_402_4.7  [402]
R165  100K,1%  RES_100K_1/16W_1%_0402_402_100K  [402]
U8  TPS2051 (DGN)  TPS2061_1_DGN-16X60_TPS2051__DG  [DGN-16X60]
U9  TPD4S012  PROT_TPD4S012_U_6_DRY_TPD4S012  [U_6_DRY]
U10  TPD4S012  PROT_TPD4S012_U_6_DRY_TPD4S012  [U_6_DRY]
U15  SN74LVC2G241  IC_SN74LVC2G241_1_U_8_DCU_SN74L  [U_8_DCU]

### Nets
AIN0: U5.B6 ; also sheet 11
AIN1: U5.C7 ; also sheet 11
AIN2: U5.B7 ; also sheet 11
AIN3: U5.A7 ; also sheet 11
AIN4: U5.C8 ; also sheet 11
AIN5: U5.B8 ; also sheet 11
AIN6: U5.A8 ; also sheet 11
AIN7: R163.2 R164.1 U5.C9
B_UART0_RX: J1.4 R165.1 U15.2
B_UART0_TX: J1.5 U15.3
DGND: C34.2 C35.2 C36.2 C155.1 J1.1 P3.4 P4.5 R49.1 R53.2 R164.2 R165.2 U8.1 U8.9 U9.4 U10.4 U15.1 U15.4 ; supply symbol labelled GND_SIGNAL_DGND ; also sheet 2,3,5,6,7,8,9,10,11
GND_EARTH: P3.5 P3.6 P4.6 P4.7 P4.8 P4.9 ; supply symbol labelled GND_EARTH_GND_EARTH ; also sheet 2,9,10,11
GNDA_ADC: C31.2 C32.2 C33.2 U5.A9 ; supply symbol labelled GND_POWER_GNDA_ADC ; also sheet 5,11
GPIO0_7: R50.1 R51.1 ; also sheet 11
GPIO0_7SRC: R50.2 U5.C18
GPIO3_18: R51.2 U5.B12
GPIO3_19: U5.C13 ; also sheet 11
GPIO3_20: U5.D13 ; also sheet 3
GPIO3_21: U5.A14 ; also sheet 3,11
I2C0_SCL: U5.C16 ; also sheet 2,10,11
I2C0_SDA: U5.C17 ; also sheet 2,10,11
I2C1_SCL: U5.A16 ; also sheet 11
I2C1_SDA: U5.B16 ; also sheet 11
I2C2_SCL: U5.D17 ; also sheet 11
I2C2_SDA: U5.D18 ; also sheet 11
LCD_DATA0: U5.R1 ; also sheet 6,10,11
LCD_DATA1: U5.R2 ; also sheet 6,10,11
LCD_DATA2: U5.R3 ; also sheet 6,10,11
LCD_DATA3: U5.R4 ; also sheet 6,10,11
LCD_DATA4: U5.T1 ; also sheet 6,10,11
LCD_DATA5: U5.T2 ; also sheet 6,10,11
LCD_DATA6: U5.T3 ; also sheet 6,10,11
LCD_DATA7: U5.T4 ; also sheet 6,10,11
LCD_DATA8: U5.U1 ; also sheet 6,10,11
LCD_DATA9: U5.U2 ; also sheet 6,10,11
LCD_DATA10: U5.U3 ; also sheet 6,10,11
LCD_DATA11: U5.U4 ; also sheet 6,10,11
LCD_DATA12: U5.V2 ; also sheet 6,10,11
LCD_DATA13: U5.V3 ; also sheet 6,10,11
LCD_DATA14: U5.V4 ; also sheet 6,10,11
LCD_DATA15: U5.T5 ; also sheet 6,10,11
LCD_DE: R48.2 ; also sheet 10,11
LCD_HSYNC: R47.2 ; also sheet 10,11
LCD_PCLK: R45.2 ; also sheet 10,11
LCD_VSYNC: R46.2 ; also sheet 10,11
LCDDE: R48.1 U5.R6
LCDPCLK: R45.1 U5.V5
LCDVHYNC: R47.1 U5.R5
LCDVSYNC: R46.1 U5.U5
MDIO_CLK: U5.M18 ; also sheet 9
MDIO_DATA: U5.M17 ; also sheet 9
MII1_COL: U5.H16 ; also sheet 9
MII1_CRS_DV: U5.H17 ; also sheet 9
MII1_REFCLK: R28.2 ; also sheet 9
MII1_RXCLK: U5.L18 ; also sheet 9
MII1_RXD0: U5.M16 ; also sheet 9
MII1_RXD1: U5.L15 ; also sheet 9
MII1_RXD2: U5.L16 ; also sheet 9
MII1_RXD3: U5.L17 ; also sheet 9
MII1_RXDV: U5.J17 ; also sheet 9
MII1_RXERR: U5.J15 ; also sheet 9
MII1_TXCLK: U5.K18 ; also sheet 9
MII1_TXD0: U5.K17 ; also sheet 9
MII1_TXD1: U5.K16 ; also sheet 9
MII1_TXD2: U5.K15 ; also sheet 9
MII1_TXD3: U5.J18 ; also sheet 9
MII1_TXEN: U5.J16 ; also sheet 9
MMC0_CD: U5.C15 ; also sheet 3,11
N22155575: R159.2 U5.P15
PMIC_POWR_EN: U5.C6 ; also sheet 2
SPI1_CS0: U5.C12 ; also sheet 10,11
SPI1_D0: U5.B13 ; also sheet 10,11
SPI1_D1: U5.D12 ; also sheet 11
SPI1_SCLK: U5.A13 ; also sheet 10,11
SYS_5V: C34.1 U8.2 U8.3 ; supply symbol labelled VCC_BAR_SYS_5V ; also sheet 2,6,10,11
U5_H18: R28.1 U5.H18
UART0_RX: U5.E15 U15.6
UART0_TX: U5.E16 U15.5
UART1_RXD: U5.D16 ; also sheet 11
UART1_TXD: U5.D15 ; also sheet 11
UART2_RXD: U5.A17 ; also sheet 11
UART2_TXD: U5.B17 ; also sheet 11
USB0_DM: P4.2 U5.N18 U10.2
USB0_DP: P4.3 U5.N17 U10.1
USB0_ID: P4.4 U5.P16 U10.3
USB1_DM: P3.2 U5.R18 U9.2
USB1_DP: P3.3 U5.R17 U9.1
USB1_DRVVBUS: R53.1 U5.F15 U8.4
USB1_ID: R49.2 U5.P17
USB1_OCN: R52.2 U8.5 ; also sheet 3
USB1_PWR: C35.1 FB7.1 FB8.2 U8.6 U8.7 U8.8 U9.6
USB1_VBUS: FB8.1 U5.T18
USB_DC: C36.1 P4.1 R159.1 U10.6 ; supply symbol labelled VBUS_5V0_USB_DC ; also sheet 2
VBUS: FB7.2 P3.1
VDD_3V3A: R52.1 ; supply symbol labelled VCC_BAR_VDD_3V3A ; also sheet 2,3,5,6,11
VDD_3V3B: C155.2 R163.1 U15.7 U15.8 ; supply symbol labelled VCC_BAR_VDD_3V3B ; also sheet 2,3,8,9,10,11
VDD_ADC: R27.1 ; supply symbol labelled VCC_BAR_VDD_ADC ; also sheet 5,11
VREFP_ADC: C31.1 C32.1 C33.1 R27.2 U5.B9
VRTC: R26.1 ; supply symbol labelled VCC_BAR_VRTC ; also sheet 2,5
WAKEUP: R26.2 U5.C5 ; also sheet 2
Unconnected: J1.2 J1.3 J1.6 U5.E17 U5.E18 U5.F16 U5.M15 U5.P18 U9.3 U9.5 U10.5

### Notes on the sheet
- VDD_3V3B | VRTC
- AIN7
- MII1_TXCLK
- VDD_ADC
- PMIC_POWR_EN | MII1_TXD0
- WAKEUP | MII1_TXD1
- MII1_TXD2
- MII1_TXD3
- AIN0 | MII1_TXEN
- AIN1 | MII1_CRS_DV
- DGND
- AIN2 | MII1_COL
- AIN3
- AIN4 | MII1_RXCLK
- AIN5 | MII1_RXD0
- AIN6 | MII1_RXD1
- MII1_RXD2
- MII1_RXD3
- VREFP_ADC
- MII1_RXERR
- MII1_RXDV
- U5_H18
- UART2_RXD | MII1_REFCLK
- UART2_TXD | MDIO_CLK
- GNDA_ADC | GNDA_ADC
- I2C1_SDA | MDIO_DATA
- I2C1_SCL
- MMC0_CD
- LCD_DATA0
- UART0_TX
- LCD_DATA1
- Mark pin 1 clearly
- UART0_RX
- LCD_DATA2
- VDD_3V3B | LCD_DATA3
- LCD_DATA4
- LCD_DATA5
- B_UART0_RX
- LCD_DATA6
- B_UART0_TX
- LCD_DATA7
- POWERDOWN ISOLATION
- LCD_DATA8
- UART1_TXD | LCD_DATA9
- UART1_RXD | LCD_DATA10
- DGND
- I2C2_SDA | LCD_DATA11
- DGND
- I2C2_SCL | LCD_DATA12
- LCD_DATA13
- I2C0_SCL | LCD_DATA14
- UART0 Serial Port
- I2C0_SDA | LCD_DATA15
- USB to TTL
- LCDPCLK
- LCD_PCLK
- Serial Cable
- LCDVSYNC
- LCD_VSYNC
- 3.3V
- DGND | LCDVHYNC
- LCD_HSYNC
- USB0_ID | LCDDE
- LCD_DE
- USB_DC
- GPIO3_21
- SPI1_SCLK
- SPI1_D0
- SPI1_D1
- USB1_ID
- DGND | SPI1_CS0
- USB1_VBUS
- GPIO3_19
- GPIO3_20
- GPIO0_7SRC
- GPIO0_7
- GPIO3_18
- VDD_3V3A
- USB_DC
- SYS_5V
- USB1_PWR | VBUS | USB0_DP
- USB1_DM | USB0_DM
- USB1_DRVVBUS | USB1_DP
- DGND
- GND_EARTH
- DGND | DGND
- DGND
- DGND | GND_EARTH
- DGND
- DGND
- USB PC
- USB1_OCn
- DGND | CONNECTOR
- USB HOST

## Sheet 5 of 11
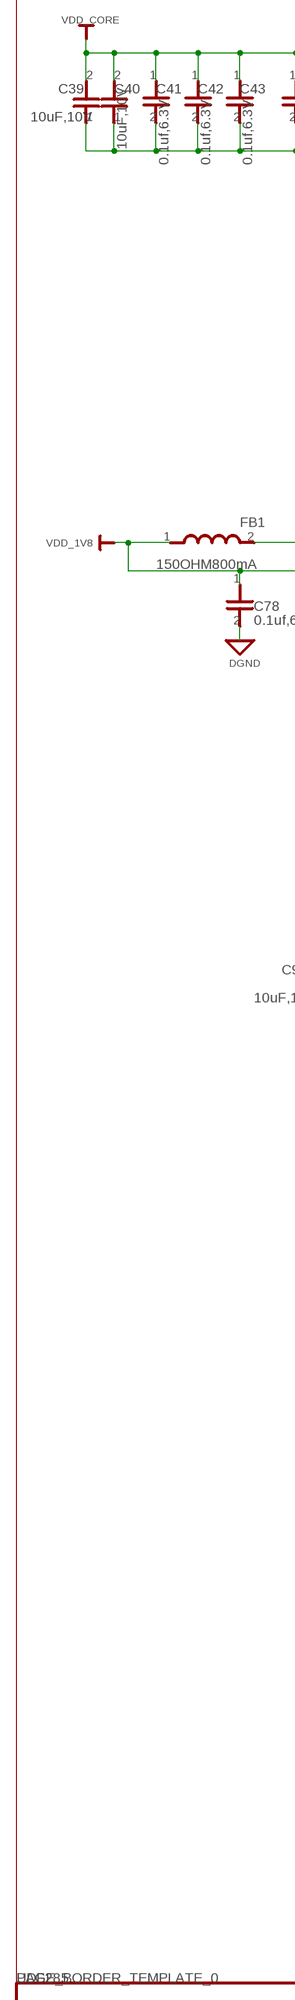
[diagram p6: schematic, sheet 5, part 1 of 2]
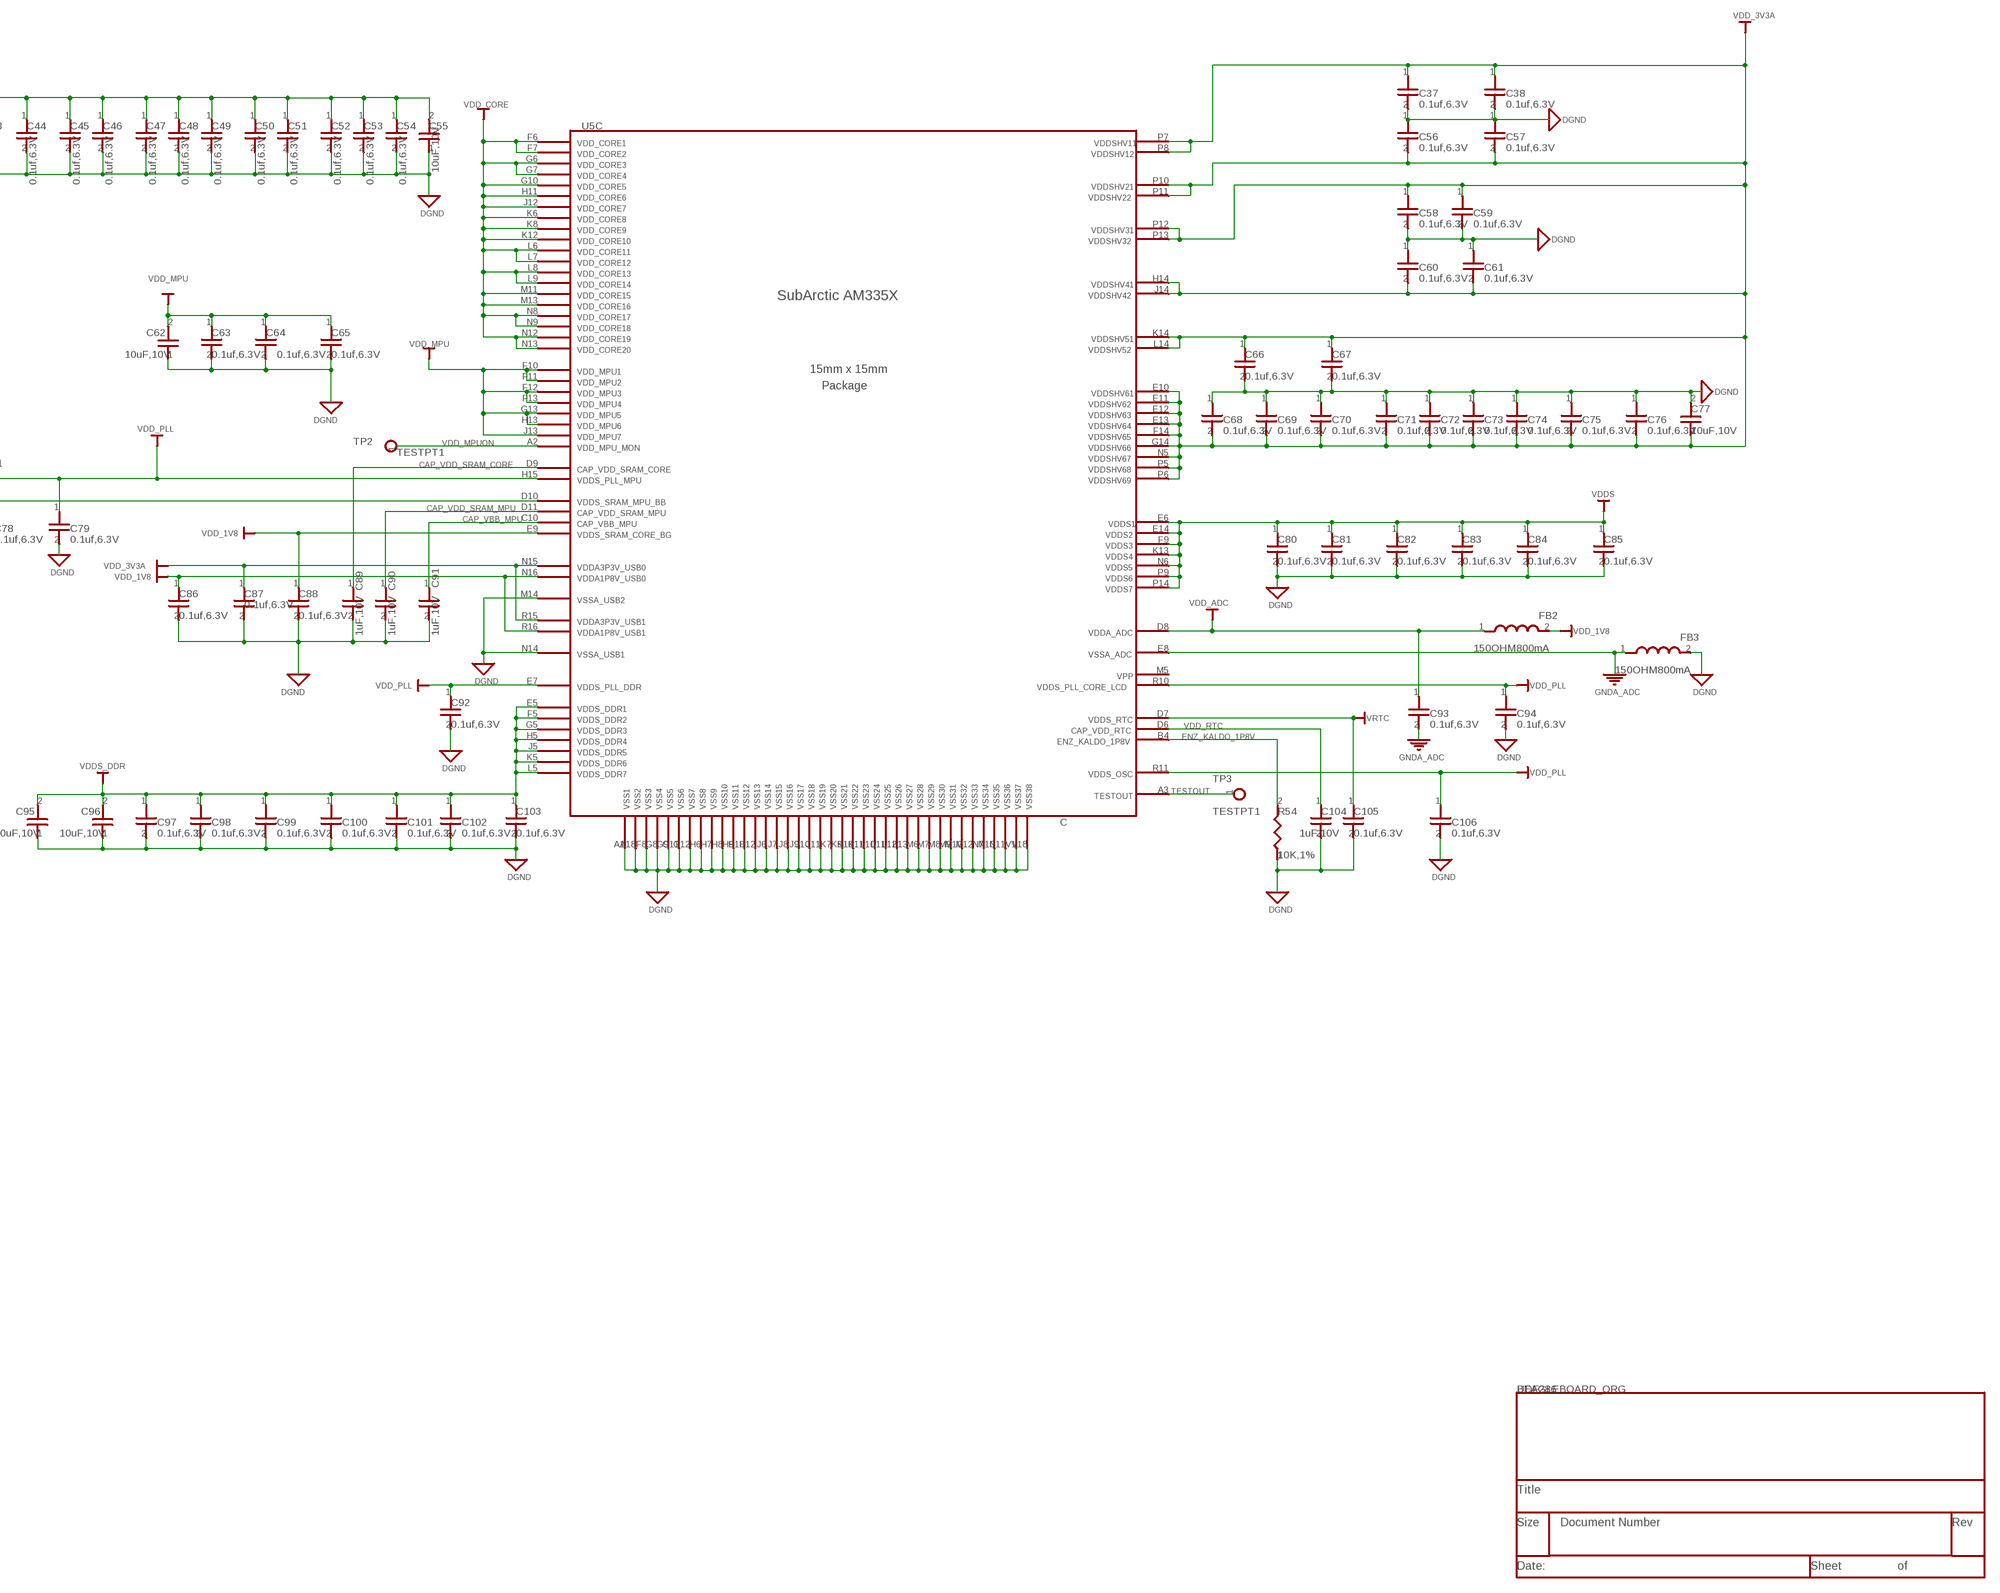
[diagram p7: schematic, sheet 5, part 2 of 2]

### Parts
C37  0.1uf,6.3V  CAP_0.1UF_X5R_6.3V_20%_0201__40  [402]
C38  0.1uf,6.3V  CAP_0.1UF_X5R_6.3V_20%_0201__40  [402]
C39  10uF,10V  CAP_10UF_Y5V_10V_10%_0805_805_1  [805]
C40  10uF,10V  CAP_10UF_Y5V_10V_10%_0805_805_1  [805]
C41  0.1uf,6.3V  CAP_0.1UF_X5R_6.3V_20%_0201__40  [402]
C42  0.1uf,6.3V  CAP_0.1UF_X5R_6.3V_20%_0201__40  [402]
C43  0.1uf,6.3V  CAP_0.1UF_X5R_6.3V_20%_0201__40  [402]
C44  0.1uf,6.3V  CAP_0.1UF_X5R_6.3V_20%_0201__40  [402]
C45  0.1uf,6.3V  CAP_0.1UF_X5R_6.3V_20%_0201__40  [402]
C46  0.1uf,6.3V  CAP_0.1UF_X5R_6.3V_20%_0201__40  [402]
C47  0.1uf,6.3V  CAP_0.1UF_X5R_6.3V_20%_0201__40  [402]
C48  0.1uf,6.3V  CAP_0.1UF_X5R_6.3V_20%_0201__40  [402]
C49  0.1uf,6.3V  CAP_0.1UF_X5R_6.3V_20%_0201__40  [402]
C50  0.1uf,6.3V  CAP_0.1UF_X5R_6.3V_20%_0201__40  [402]
C51  0.1uf,6.3V  CAP_0.1UF_X5R_6.3V_20%_0201__40  [402]
C52  0.1uf,6.3V  CAP_0.1UF_X5R_6.3V_20%_0201__40  [402]
C53  0.1uf,6.3V  CAP_0.1UF_X5R_6.3V_20%_0201__40  [402]
C54  0.1uf,6.3V  CAP_0.1UF_X5R_6.3V_20%_0201__40  [402]
C55  10uF,10V  CAP_10UF_Y5V_10V_10%_0805_805_1  [805]
C56  0.1uf,6.3V  CAP_0.1UF_X5R_6.3V_20%_0201__40  [402]
C57  0.1uf,6.3V  CAP_0.1UF_X5R_6.3V_20%_0201__40  [402]
C58  0.1uf,6.3V  CAP_0.1UF_X5R_6.3V_20%_0201__40  [402]
C59  0.1uf,6.3V  CAP_0.1UF_X5R_6.3V_20%_0201__40  [402]
C60  0.1uf,6.3V  CAP_0.1UF_X5R_6.3V_20%_0201__40  [402]
C61  0.1uf,6.3V  CAP_0.1UF_X5R_6.3V_20%_0201__40  [402]
C62  10uF,10V  CAP_10UF_Y5V_10V_10%_0805_805_1  [805]
C63  0.1uf,6.3V  CAP_0.1UF_X5R_6.3V_20%_0201__40  [402]
C64  0.1uf,6.3V  CAP_0.1UF_X5R_6.3V_20%_0201__40  [402]
C65  0.1uf,6.3V  CAP_0.1UF_X5R_6.3V_20%_0201__40  [402]
C66  0.1uf,6.3V  CAP_0.1UF_X5R_6.3V_20%_0201__40  [402]
C67  0.1uf,6.3V  CAP_0.1UF_X5R_6.3V_20%_0201__40  [402]
C68  0.1uf,6.3V  CAP_0.1UF_X5R_6.3V_20%_0201__40  [402]
C69  0.1uf,6.3V  CAP_0.1UF_X5R_6.3V_20%_0201__40  [402]
C70  0.1uf,6.3V  CAP_0.1UF_X5R_6.3V_20%_0201__40  [402]
C71  0.1uf,6.3V  CAP_0.1UF_X5R_6.3V_20%_0201__40  [402]
C72  0.1uf,6.3V  CAP_0.1UF_X5R_6.3V_20%_0201__40  [402]
C73  0.1uf,6.3V  CAP_0.1UF_X5R_6.3V_20%_0201__40  [402]
C74  0.1uf,6.3V  CAP_0.1UF_X5R_6.3V_20%_0201__40  [402]
C75  0.1uf,6.3V  CAP_0.1UF_X5R_6.3V_20%_0201__40  [402]
C76  0.1uf,6.3V  CAP_0.1UF_X5R_6.3V_20%_0201__40  [402]
C77  10uF,10V  CAP_10UF_Y5V_10V_10%_0805_805_1  [805]
C78  0.1uf,6.3V  CAP_0.1UF_X5R_6.3V_20%_0201__40  [402]
C79  0.1uf,6.3V  CAP_0.1UF_X5R_6.3V_20%_0201__40  [402]
C80  0.1uf,6.3V  CAP_0.1UF_X5R_6.3V_20%_0201__40  [402]
C81  0.1uf,6.3V  CAP_0.1UF_X5R_6.3V_20%_0201__40  [402]
C82  0.1uf,6.3V  CAP_0.1UF_X5R_6.3V_20%_0201__40  [402]
C83  0.1uf,6.3V  CAP_0.1UF_X5R_6.3V_20%_0201__40  [402]
C84  0.1uf,6.3V  CAP_0.1UF_X5R_6.3V_20%_0201__40  [402]
C85  0.1uf,6.3V  CAP_0.1UF_X5R_6.3V_20%_0201__40  [402]
C86  0.1uf,6.3V  CAP_0.1UF_X5R_6.3V_20%_0201__40  [402]
C87  0.1uf,6.3V  CAP_0.1UF_X5R_6.3V_20%_0201__40  [402]
C88  0.1uf,6.3V  CAP_0.1UF_X5R_6.3V_20%_0201__40  [402]
C89  1uF,10V  CAP_1.0UF_X5R_10V_10%_0402_402_  [402]
C90  1uF,10V  CAP_1.0UF_X5R_10V_10%_0402_402_  [402]
C91  1uF,10V  CAP_1.0UF_X5R_10V_10%_0402_402_  [402]
C92  0.1uf,6.3V  CAP_0.1UF_X5R_6.3V_20%_0201__40  [402]
C93  0.1uf,6.3V  CAP_0.1UF_X5R_6.3V_20%_0201__40  [402]
C94  0.1uf,6.3V  CAP_0.1UF_X5R_6.3V_20%_0201__40  [402]
C95  10uF,10V  CAP_10UF_Y5V_10V_10%_0805_805_1  [805]
C96  10uF,10V  CAP_10UF_Y5V_10V_10%_0805_805_1  [805]
C97  0.1uf,6.3V  CAP_0.1UF_X5R_6.3V_20%_0201__40  [402]
C98  0.1uf,6.3V  CAP_0.1UF_X5R_6.3V_20%_0201__40  [402]
C99  0.1uf,6.3V  CAP_0.1UF_X5R_6.3V_20%_0201__40  [402]
C100  0.1uf,6.3V  CAP_0.1UF_X5R_6.3V_20%_0201__40  [402]
C101  0.1uf,6.3V  CAP_0.1UF_X5R_6.3V_20%_0201__40  [402]
C102  0.1uf,6.3V  CAP_0.1UF_X5R_6.3V_20%_0201__40  [402]
C103  0.1uf,6.3V  CAP_0.1UF_X5R_6.3V_20%_0201__40  [402]
C104  1uF,10V  CAP_1.0UF_X5R_10V_10%_0402_402_  [402]
C105  0.1uf,6.3V  CAP_0.1UF_X5R_6.3V_20%_0201__40  [402]
C106  0.1uf,6.3V  CAP_0.1UF_X5R_6.3V_20%_0201__40  [402]
FB1  150OHM800mA  FER_180_200_0_SM-7351-IND-0805_  [SM-7351-IND-0805]
FB2  150OHM800mA  FER_180_200_0_SM-7351-IND-0805_  [SM-7351-IND-0805]
FB3  150OHM800mA  FER_180_200_0_SM-7351-IND-0805_  [SM-7351-IND-0805]
R54  10K,1%  RES_10K_1/16W_1%_0402_402_10K_1  [402]
TP2  TESTPT1  TESTPT1_TP60C_SMD  [TP60C_SMD]
TP3  TESTPT1  TESTPT1_TP60C_SMD  [TP60C_SMD]

### Nets
CAP_VBB_MPU: C91.1 U5.C10
CAP_VDD_SRAM_CORE: C89.1 U5.D9
CAP_VDD_SRAM_MPU: C90.1 U5.D11
DGND: C37.2 C38.2 C39.1 C40.1 C41.2 C42.2 C43.2 C44.2 C45.2 C46.2 C47.2 C48.2 C49.2 C50.2 C51.2 C52.2 C53.2 C54.2 C55.1 C56.1 C57.1 C58.2 C59.2 C60.1 C61.1 C62.1 C63.2 C64.2 C65.2 C66.2 C67.2 C68.1 C69.1 C70.1 C71.1 C72.1 C73.1 C74.1 C75.1 C76.1 C77.2 C78.2 C79.2 C80.2 C81.2 C82.2 C83.2 C84.2 C85.2 C86.2 C87.2 C88.2 C89.2 C90.2 C91.2 C92.2 C94.2 C95.1 C96.1 C97.2 C98.2 C99.2 C100.2 C101.2 C102.2 C103.2 C104.2 C105.2 C106.2 FB3.2 R54.1 U5.A1 U5.A18 U5.F8 U5.G8 U5.G9 U5.G11 U5.G12 U5.H6 U5.H7 U5.H8 U5.H9 U5.H10 U5.H12 U5.J6 U5.J7 U5.J8 U5.J9 U5.J10 U5.J11 U5.K7 U5.K9 U5.K10 U5.K11 U5.L10 U5.L11 U5.L12 U5.L13 U5.M6 U5.M7 U5.M8 U5.M9 U5.M10 U5.M12 U5.M14 U5.N7 U5.N10 U5.N11 U5.N14 U5.V1 U5.V18 ; supply symbol labelled GND_SIGNAL_DGND ; also sheet 2,3,4,6,7,8,9,10,11
ENZ_KALDO_1P8V: R54.2 U5.B4
GNDA_ADC: C93.2 FB3.1 U5.E8 ; supply symbol labelled GND_POWER_GNDA_ADC ; also sheet 4,11
TESTOUT: TP3.1 U5.A3
VDD_1V8: C78.1 C86.1 C88.1 FB1.1 FB2.2 U5.D10 U5.E9 U5.N16 U5.R16 ; supply symbol labelled VCC_BAR_VDD_1V8 ; also sheet 2,10
VDD_3V3A: C37.1 C38.1 C56.2 C57.2 C58.1 C59.1 C60.2 C61.2 C66.1 C67.1 C68.2 C69.2 C70.2 C71.2 C72.2 C73.2 C74.2 C75.2 C76.2 C77.1 C87.1 U5.E10 U5.E11 U5.E12 U5.E13 U5.F14 U5.G14 U5.H14 U5.J14 U5.K14 U5.L14 U5.N5 U5.N15 U5.P5 U5.P6 U5.P7 U5.P8 U5.P10 U5.P11 U5.P12 U5.P13 U5.R15 ; supply symbol labelled VCC_BAR_VDD_3V3A ; also sheet 2,3,4,6,11
VDD_ADC: C93.1 FB2.1 U5.D8 ; supply symbol labelled VCC_BAR_VDD_ADC ; also sheet 4,11
VDD_CORE: C39.2 C40.2 C41.1 C42.1 C43.1 C44.1 C45.1 C46.1 C47.1 C48.1 C49.1 C50.1 C51.1 C52.1 C53.1 C54.1 C55.2 U5.F6 U5.F7 U5.G6 U5.G7 U5.G10 U5.H11 U5.J12 U5.K6 U5.K8 U5.K12 U5.L6 U5.L7 U5.L8 U5.L9 U5.M11 U5.M13 U5.N8 U5.N9 U5.N12 U5.N13 ; supply symbol labelled VCC_BAR_VDD_CORE ; also sheet 2
VDD_MPU: C62.2 C63.1 C64.1 C65.1 U5.F10 U5.F11 U5.F12 U5.F13 U5.G13 U5.H13 U5.J13 ; supply symbol labelled VCC_BAR_VDD_MPU ; also sheet 2
VDD_MPUON: TP2.1 U5.A2
VDD_PLL: C79.1 C92.1 C94.1 C106.1 FB1.2 U5.E7 U5.H15 U5.R10 U5.R11 ; supply symbol labelled VCC_BAR_VDD_PLL
VDD_RTC: C104.1 U5.D6
VDDS: C80.1 C81.1 C82.1 C83.1 C84.1 C85.1 U5.E6 U5.E14 U5.F9 U5.K13 U5.N6 U5.P9 U5.P14 ; supply symbol labelled VCC_BAR_VDDS ; also sheet 2
VDDS_DDR: C95.2 C96.2 C97.1 C98.1 C99.1 C100.1 C101.1 C102.1 C103.1 U5.E5 U5.F5 U5.G5 U5.H5 U5.J5 U5.K5 U5.L5 ; supply symbol labelled VCC_BAR_VDDS_DDR ; also sheet 2,7
VRTC: C105.1 U5.D7 ; supply symbol labelled VCC_BAR_VRTC ; also sheet 2,4
Unconnected: U5.M5

### Notes on the sheet
- VDD_3V3A
- VDD_CORE
- VDD_CORE
- DGND
- DGND
- DGND
- VDD_MPU
- VDD_MPU
- DGND
- DGND
- VDD_PLL
- VDD_MPUON
- CAP_VDD_SRAM_CORE
- VDD_1V8
- VDDS
- CAP_VDD_SRAM_MPU
- CAP_VBB_MPU
- VDD_1V8
- VDD_3V3A
- DGND | DGND
- VDD_1V8
- VDD_ADC | DGND
- VDD_1V8
- DGND
- VDD_PLL | VDD_PLL
- DGND | GNDA_ADC | DGND
- VRTC
- VDD_RTC
- ENZ_KALDO_1P8V
- GNDA_ADC | DGND
- VDDS_DDR | DGND
- VDD_PLL
- TESTOUT
- DGND | DGND
- DGND | DGND

## Sheet 6 of 11
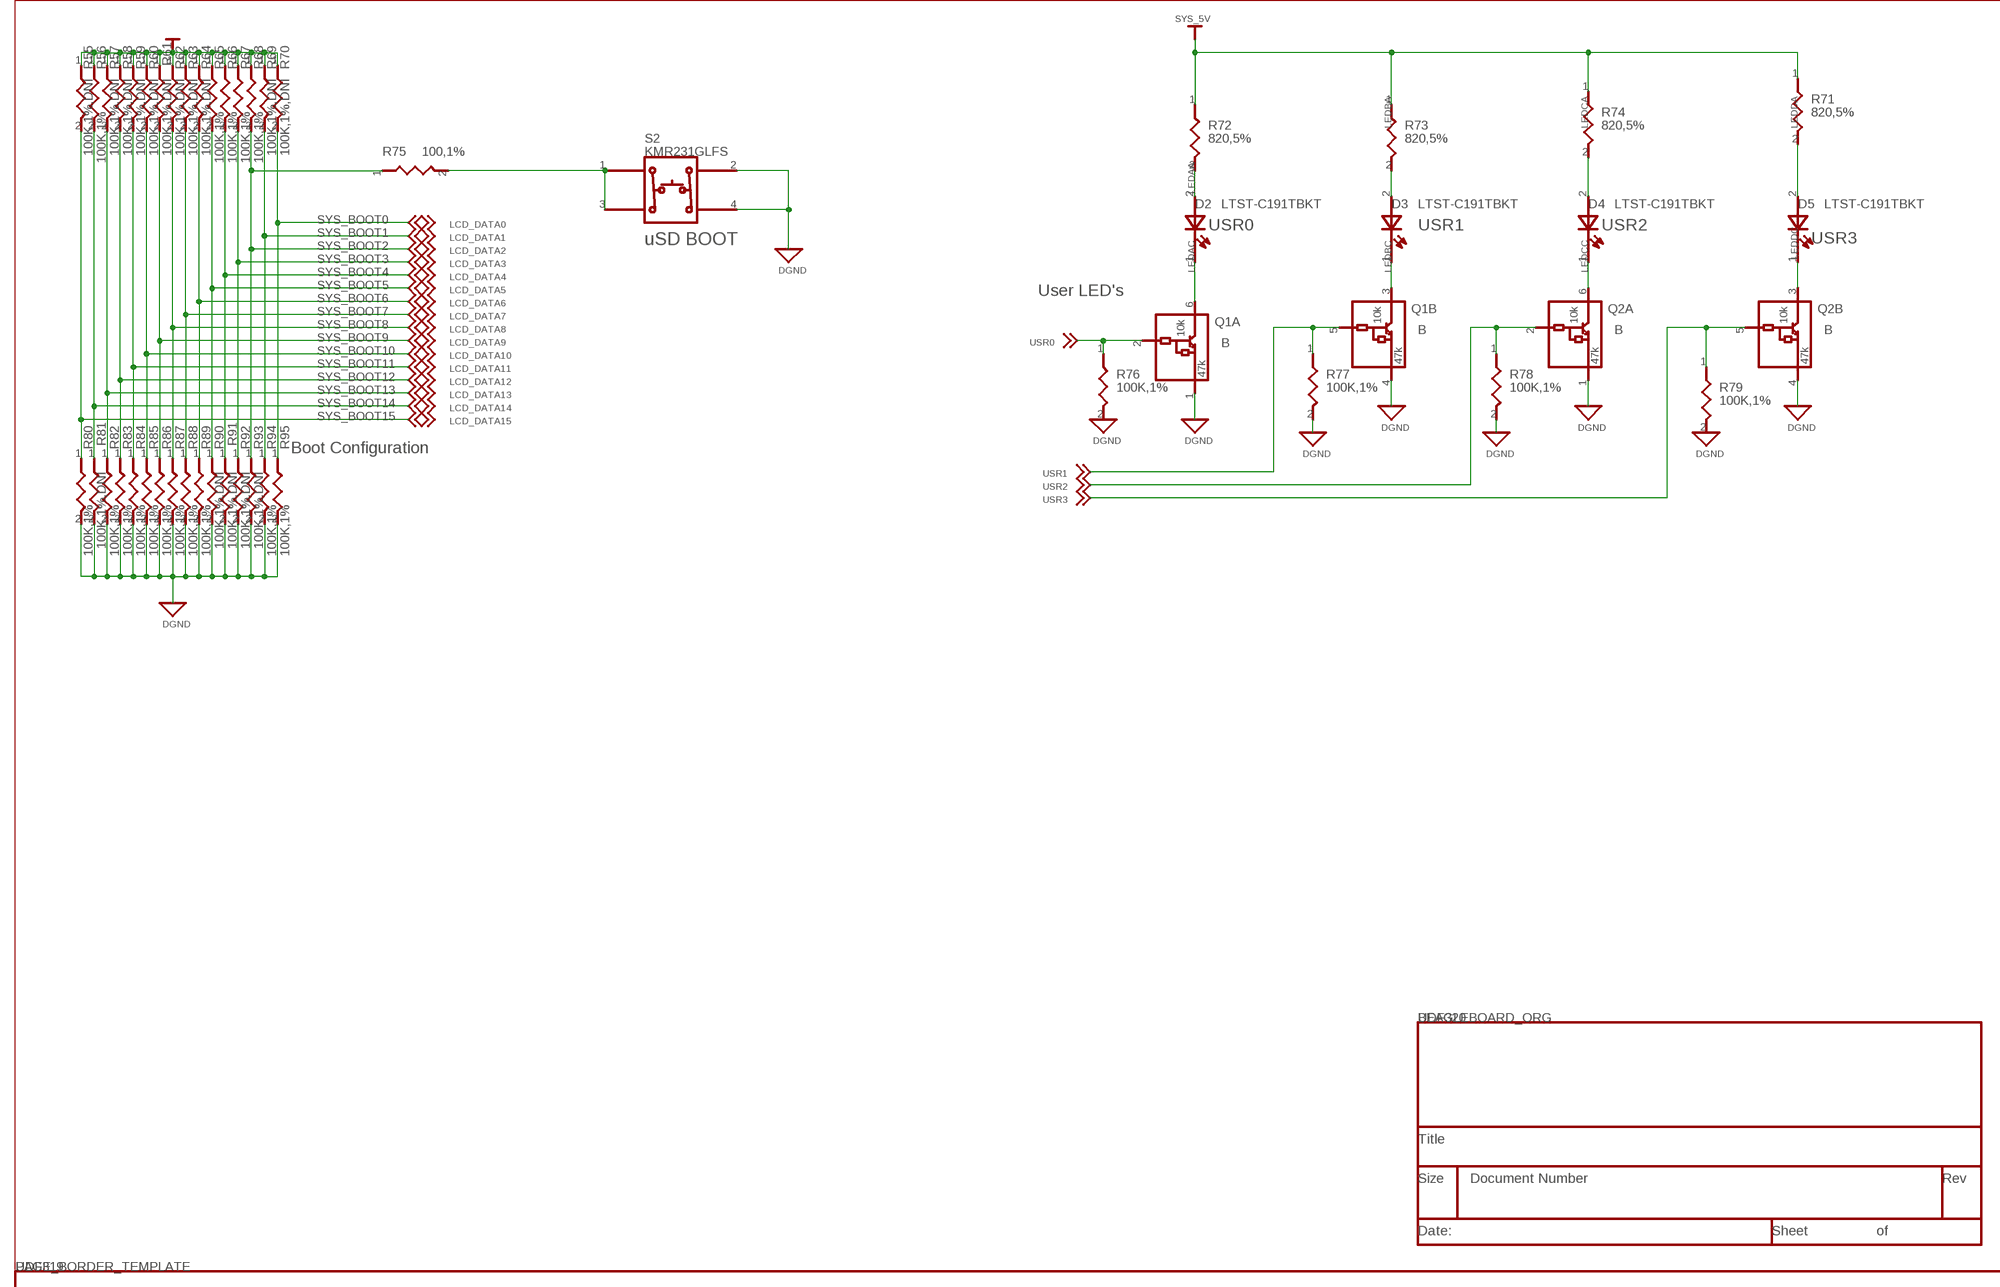
[diagram p8: schematic, sheet 6]

### Parts
D2  LTST-C191TBKT  LED_LTST-C150GKT_0_LED_0603_DIS  [LED_0603]
D3  LTST-C191TBKT  LED_LTST-C150GKT_0_LED_0603_DIS  [LED_0603]
D4  LTST-C191TBKT  LED_LTST-C150GKT_0_LED_0603_DIS  [LED_0603]
D5  LTST-C191TBKT  LED_LTST-C150GKT_0_LED_0603_DIS  [LED_0603]
Q1  B  RN1907_SMINI6-F3-B_DMC56404  [SMINI6-F3-B]
Q2  B  RN1907_SMINI6-F3-B_DMC56404  [SMINI6-F3-B]
R55  100K,1%,DNI  RES_100K_1/16W_1%_0402_402_10_1  [402]
R56  100K,1%  RES_100K_1/16W_1%_0402_402_100K  [402]
R57  100K,1%,DNI  RES_100K_1/16W_1%_0402_402_10_1  [402]
R58  100K,1%,DNI  RES_100K_1/16W_1%_0402_402_10_1  [402]
R59  100K,1%,DNI  RES_100K_1/16W_1%_0402_402_10_1  [402]
R60  100K,1%,DNI  RES_100K_1/16W_1%_0402_402_10_1  [402]
R61  100K,1%,DNI  RES_100K_1/16W_1%_0402_402_10_1  [402]
R62  100K,1%,DNI  RES_100K_1/16W_1%_0402_402_10_1  [402]
R63  100K,1%,DNI  RES_100K_1/16W_1%_0402_402_10_1  [402]
R64  100K,1%,DNI  RES_100K_1/16W_1%_0402_402_10_1  [402]
R65  100K,1%  RES_100K_1/16W_1%_0402_402_100K  [402]
R66  100K,1%  RES_100K_1/16W_1%_0402_402_100K  [402]
R67  100K,1%  RES_100K_1/16W_1%_0402_402_100K  [402]
R68  100K,1%  RES_100K_1/16W_1%_0402_402_100K  [402]
R69  100K,1%,DNI  RES_100K_1/16W_1%_0402_402_10_1  [402]
R70  100K,1%,DNI  RES_100K_1/16W_1%_0402_402_10_1  [402]
R71  820,5%  RES_470_1/10W_5%_0402_402_820_5  [402]
R72  820,5%  RES_470_1/10W_5%_0402_402_820_5  [402]
R73  820,5%  RES_470_1/10W_5%_0402_402_820_5  [402]
R74  820,5%  RES_470_1/10W_5%_0402_402_820_5  [402]
R75  100,1%  RES_100K_1/16W_1%_0402_402_100_  [402]
R76  100K,1%  RES_100K_1/16W_1%_0402_402_100K  [402]
R77  100K,1%  RES_100K_1/16W_1%_0402_402_100K  [402]
R78  100K,1%  RES_100K_1/16W_1%_0402_402_100K  [402]
R79  100K,1%  RES_100K_1/16W_1%_0402_402_100K  [402]
R80  100K,1%  RES_100K_1/16W_1%_0402_402_100K  [402]
R81  100K,1%,DNI  RES_100K_1/16W_1%_0402_402_10_1  [402]
R82  100K,1%  RES_100K_1/16W_1%_0402_402_100K  [402]
R83  100K,1%  RES_100K_1/16W_1%_0402_402_100K  [402]
R84  100K,1%  RES_100K_1/16W_1%_0402_402_100K  [402]
R85  100K,1%  RES_100K_1/16W_1%_0402_402_100K  [402]
R86  100K,1%  RES_100K_1/16W_1%_0402_402_100K  [402]
R87  100K,1%  RES_100K_1/16W_1%_0402_402_100K  [402]
R88  100K,1%  RES_100K_1/16W_1%_0402_402_100K  [402]
R89  100K,1%  RES_100K_1/16W_1%_0402_402_100K  [402]
R90  100K,1%,DNI  RES_100K_1/16W_1%_0402_402_10_1  [402]
R91  100K,1%,DNI  RES_100K_1/16W_1%_0402_402_10_1  [402]
R92  100K,1%,DNI  RES_100K_1/16W_1%_0402_402_10_1  [402]
R93  100K,1%,DNI  RES_100K_1/16W_1%_0402_402_10_1  [402]
R94  100K,1%  RES_100K_1/16W_1%_0402_402_100K  [402]
R95  100K,1%  RES_100K_1/16W_1%_0402_402_100K  [402]
S2  KMR231GLFS  SW_KT11P2JM_1_SW4SMD_63X161LS_D  [SW4SMD_63X161LS]

### Nets
DGND: Q1.1 Q1.4 Q2.1 Q2.4 R76.2 R77.2 R78.2 R79.2 R80.2 R81.2 R82.2 R83.2 R84.2 R85.2 R86.2 R87.2 R88.2 R89.2 R90.2 R91.2 R92.2 R93.2 R94.2 R95.2 S2.2 S2.4 ; supply symbol labelled GND_SIGNAL_DGND ; also sheet 2,3,4,5,7,8,9,10,11
LCD_DATA0: R70.2 R95.1 ; also sheet 4,10,11
LCD_DATA1: R69.2 R94.1 ; also sheet 4,10,11
LCD_DATA2: R68.2 R75.1 R93.1 ; also sheet 4,10,11
LCD_DATA3: R67.2 R92.1 ; also sheet 4,10,11
LCD_DATA4: R66.2 R91.1 ; also sheet 4,10,11
LCD_DATA5: R65.2 R90.1 ; also sheet 4,10,11
LCD_DATA6: R64.2 R89.1 ; also sheet 4,10,11
LCD_DATA7: R63.2 R88.1 ; also sheet 4,10,11
LCD_DATA8: R62.2 R87.1 ; also sheet 4,10,11
LCD_DATA9: R61.2 R86.1 ; also sheet 4,10,11
LCD_DATA10: R60.2 R85.1 ; also sheet 4,10,11
LCD_DATA11: R59.2 R84.1 ; also sheet 4,10,11
LCD_DATA12: R58.2 R83.1 ; also sheet 4,10,11
LCD_DATA13: R57.2 R82.1 ; also sheet 4,10,11
LCD_DATA14: R56.2 R81.1 ; also sheet 4,10,11
LCD_DATA15: R55.2 R80.1 ; also sheet 4,10,11
LEDAA: D2.2 R72.2
LEDAC: D2.1 Q1.6
LEDBA: D3.2 R73.2
LEDBC: D3.1 Q1.3
LEDCA: D4.2 R74.2
LEDCC: D4.1 Q2.6
LEDDA: D5.2 R71.2
LEDDC: D5.1 Q2.3
N21769115: R75.2 S2.1 S2.3
SYS_5V: R71.1 R72.1 R73.1 R74.1 ; supply symbol labelled VCC_BAR_SYS_5V ; also sheet 2,4,10,11
USR0: Q1.2 R76.1 ; also sheet 3
USR1: Q1.5 R77.1 ; also sheet 3
USR2: Q2.2 R78.1 ; also sheet 3
USR3: Q2.5 R79.1 ; also sheet 3
VDD_3V3A: R55.1 R56.1 R57.1 R58.1 R59.1 R60.1 R61.1 R62.1 R63.1 R64.1 R65.1 R66.1 R67.1 R68.1 R69.1 R70.1 ; supply symbol labelled VCC_BAR_VDD_3V3A ; also sheet 2,3,4,5,11

### Notes on the sheet
- SYS_5V
- LEDBA | LEDCA | LEDDA
- LEDAA
- SYS_BOOT0
- LCD_DATA0 | USR0 | USR1 | USR2
- SYS_BOOT1
- LCD_DATA1 | USR3
- uSD BOOT
- SYS_BOOT2
- LCD_DATA2
- SYS_BOOT3 | LEDDC
- LCD_DATA3
- SYS_BOOT4 | DGND | LEDAC | LEDBC | LEDCC
- LCD_DATA4
- SYS_BOOT5
- LCD_DATA5 | User LED's
- SYS_BOOT6
- LCD_DATA6
- SYS_BOOT7
- LCD_DATA7
- SYS_BOOT8
- LCD_DATA8
- SYS_BOOT9
- LCD_DATA9 | USR0
- SYS_BOOT10
- LCD_DATA10
- SYS_BOOT11
- LCD_DATA11
- SYS_BOOT12
- LCD_DATA12
- SYS_BOOT13
- LCD_DATA13
- SYS_BOOT14
- LCD_DATA14
- SYS_BOOT15
- LCD_DATA15
- DGND | DGND | DGND
- DGND | DGND
- Boot Configuration
- DGND | DGND | DGND
- USR1
- USR2
- USR3
- DGND

## Sheet 7 of 11
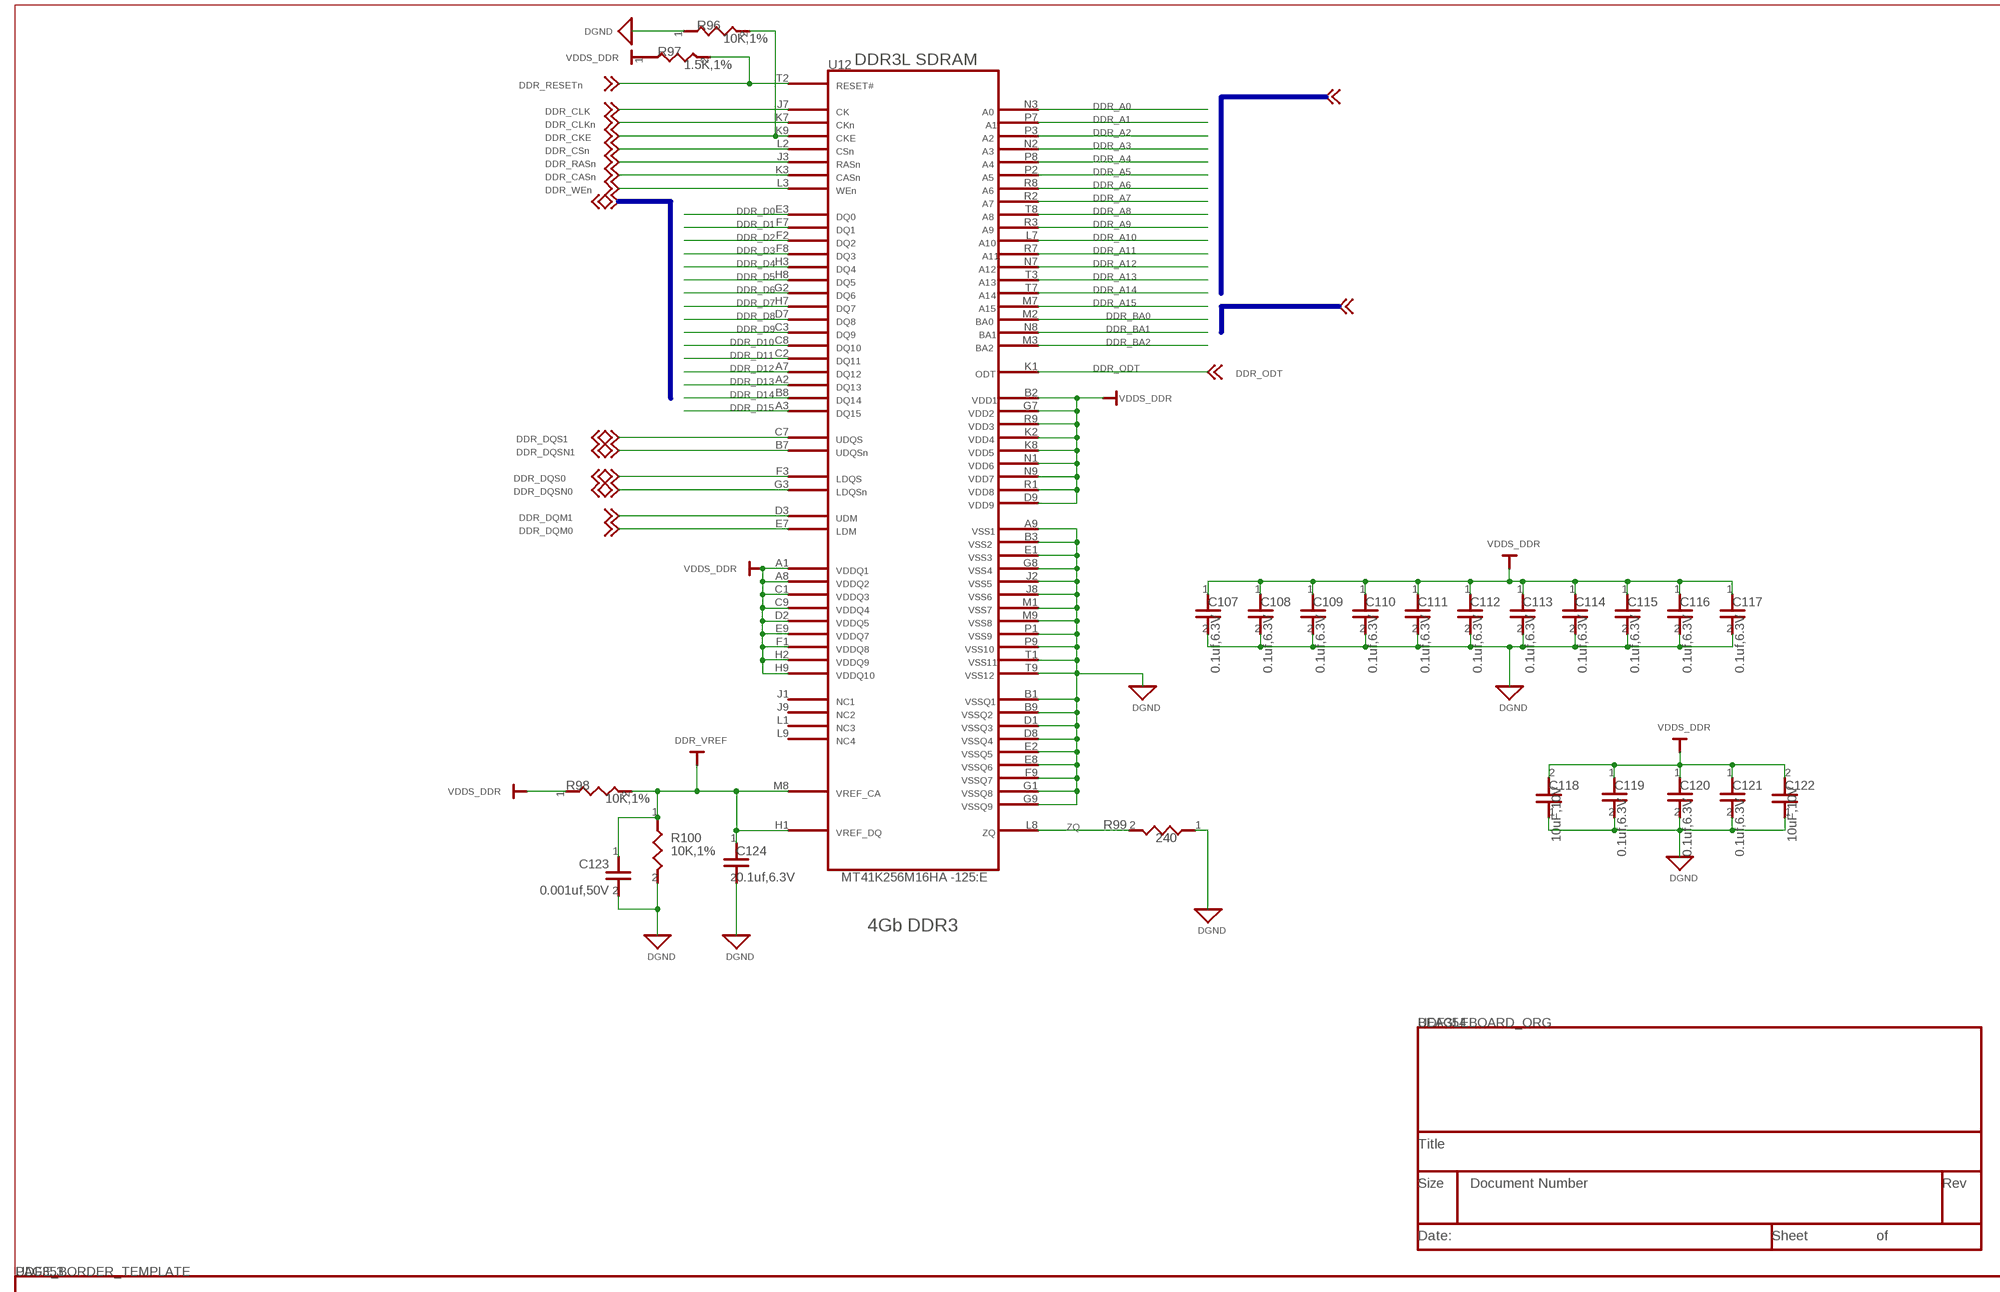
[diagram p9: schematic, sheet 7]

### Parts
C107  0.1uf,6.3V  CAP_0.1UF_X5R_6.3V_20%_0201__40  [402]
C108  0.1uf,6.3V  CAP_0.1UF_X5R_6.3V_20%_0201__40  [402]
C109  0.1uf,6.3V  CAP_0.1UF_X5R_6.3V_20%_0201__40  [402]
C110  0.1uf,6.3V  CAP_0.1UF_X5R_6.3V_20%_0201__40  [402]
C111  0.1uf,6.3V  CAP_0.1UF_X5R_6.3V_20%_0201__40  [402]
C112  0.1uf,6.3V  CAP_0.1UF_X5R_6.3V_20%_0201__40  [402]
C113  0.1uf,6.3V  CAP_0.1UF_X5R_6.3V_20%_0201__40  [402]
C114  0.1uf,6.3V  CAP_0.1UF_X5R_6.3V_20%_0201__40  [402]
C115  0.1uf,6.3V  CAP_0.1UF_X5R_6.3V_20%_0201__40  [402]
C116  0.1uf,6.3V  CAP_0.1UF_X5R_6.3V_20%_0201__40  [402]
C117  0.1uf,6.3V  CAP_0.1UF_X5R_6.3V_20%_0201__40  [402]
C118  10uF,10V  CAP_10UF_Y5V_10V_10%_0805_805_1  [805]
C119  0.1uf,6.3V  CAP_0.1UF_X5R_6.3V_20%_0201__40  [402]
C120  0.1uf,6.3V  CAP_0.1UF_X5R_6.3V_20%_0201__40  [402]
C121  0.1uf,6.3V  CAP_0.1UF_X5R_6.3V_20%_0201__40  [402]
C122  10uF,10V  CAP_10UF_Y5V_10V_10%_0805_805_1  [805]
C123  0.001uf,50V  CAP_0.001_X7R_50V_5%_0402_402_0  [402]
C124  0.1uf,6.3V  CAP_0.1UF_X5R_6.3V_20%_0201__40  [402]
R96  10K,1%  RES_10K_1/16W_1%_0402_402_10K_1_2  [402]
R97  1.5K,1%  RES_10K_1/16W_1%_0402_402_1.5K_  [402]
R98  10K,1%  RES_10K_1/16W_1%_0402_402_10K_1  [402]
R99  240  RES_SM-7351-RES-0402_240  [SM-7351-RES-0402]
R100  10K,1%  RES_10K_1/16W_1%_0402_402_10K_1  [402]
U12  MT41K256M16HA -125:E  MT47H256M8_7_BGA96_T9_P8_9X14_M  [BGA96_T9_P8_9X14]

### Nets
DDR_A0: U12.N3 ; also sheet 3
DDR_A1: U12.P7 ; also sheet 3
DDR_A2: U12.P3 ; also sheet 3
DDR_A3: U12.N2 ; also sheet 3
DDR_A4: U12.P8 ; also sheet 3
DDR_A5: U12.P2 ; also sheet 3
DDR_A6: U12.R8 ; also sheet 3
DDR_A7: U12.R2 ; also sheet 3
DDR_A8: U12.T8 ; also sheet 3
DDR_A9: U12.R3 ; also sheet 3
DDR_A10: U12.L7 ; also sheet 3
DDR_A11: U12.R7 ; also sheet 3
DDR_A12: U12.N7 ; also sheet 3
DDR_A13: U12.T3 ; also sheet 3
DDR_A14: U12.T7 ; also sheet 3
DDR_A15: U12.M7 ; also sheet 3
DDR_BA0: U12.M2 ; also sheet 3
DDR_BA1: U12.N8 ; also sheet 3
DDR_BA2: U12.M3 ; also sheet 3
DDR_CASN: U12.K3 ; also sheet 3
DDR_CKE: R96.2 U12.K9 ; also sheet 3
DDR_CLK: U12.J7 ; also sheet 3
DDR_CLKN: U12.K7 ; also sheet 3
DDR_CSN: U12.L2 ; also sheet 3
DDR_D0: U12.E3 ; also sheet 3
DDR_D1: U12.F7 ; also sheet 3
DDR_D2: U12.F2 ; also sheet 3
DDR_D3: U12.F8 ; also sheet 3
DDR_D4: U12.H3 ; also sheet 3
DDR_D5: U12.H8 ; also sheet 3
DDR_D6: U12.G2 ; also sheet 3
DDR_D7: U12.H7 ; also sheet 3
DDR_D8: U12.D7 ; also sheet 3
DDR_D9: U12.C3 ; also sheet 3
DDR_D10: U12.C8 ; also sheet 3
DDR_D11: U12.C2 ; also sheet 3
DDR_D12: U12.A7 ; also sheet 3
DDR_D13: U12.A2 ; also sheet 3
DDR_D14: U12.B8 ; also sheet 3
DDR_D15: U12.A3 ; also sheet 3
DDR_DQM0: U12.E7 ; also sheet 3
DDR_DQM1: U12.D3 ; also sheet 3
DDR_DQS0: U12.F3 ; also sheet 3
DDR_DQS1: U12.C7 ; also sheet 3
DDR_DQSN0: U12.G3 ; also sheet 3
DDR_DQSN1: U12.B7 ; also sheet 3
DDR_ODT: U12.K1 ; also sheet 3
DDR_RASN: U12.J3 ; also sheet 3
DDR_RESETN: R97.2 U12.T2 ; also sheet 3
DDR_VREF: C123.1 C124.1 R98.2 R100.1 U12.H1 U12.M8 ; supply symbol labelled VDD_1V8_DDR_VREF ; also sheet 3
DDR_WEN: U12.L3 ; also sheet 3
DGND: C107.2 C108.2 C109.2 C110.2 C111.2 C112.2 C113.2 C114.2 C115.2 C116.2 C117.2 C118.1 C119.2 C120.2 C121.2 C122.1 C123.2 C124.2 R96.1 R99.1 R100.2 U12.A9 U12.B1 U12.B3 U12.B9 U12.D1 U12.D8 U12.E1 U12.E2 U12.E8 U12.F9 U12.G1 U12.G8 U12.G9 U12.J2 U12.J8 U12.M1 U12.M9 U12.P1 U12.P9 U12.T1 U12.T9 ; supply symbol labelled GND_SIGNAL_DGND ; also sheet 2,3,4,5,6,8,9,10,11
VDDS_DDR: C107.1 C108.1 C109.1 C110.1 C111.1 C112.1 C113.1 C114.1 C115.1 C116.1 C117.1 C118.2 C119.1 C120.1 C121.1 C122.2 R97.1 R98.1 U12.A1 U12.A8 U12.B2 U12.C1 U12.C9 U12.D2 U12.D9 U12.E9 U12.F1 U12.G7 U12.H2 U12.H9 U12.K2 U12.K8 U12.N1 U12.N9 U12.R1 U12.R9 ; supply symbol labelled VDD_1V8_VDDS_DDR ; also sheet 2,5
ZQ: R99.2 U12.L8
Unconnected: U12.J1 U12.J9 U12.L1 U12.L9

### Buses
BUS3
BUS4
BUS5

### Notes on the sheet
- DGND
- VDDS_DDR
- DDR3L SDRAM
- DDR_RESETn
- DDR_A0
- DDR_CLK
- DDR_A1
- DDR_CLKn
- DDR_A2
- DDR_CKE
- DDR_A3
- DDR_CSn
- DDR_A4
- DDR_RASn
- DDR_A5
- DDR_CASn
- DDR_A6
- DDR_WEn
- DDR_A7
- DDR_D0 | DDR_A8
- DDR_D1 | DDR_A9
- DDR_D2 | DDR_A10
- DDR_D3 | DDR_A11
- DDR_D4 | DDR_A12
- DDR_D5 | DDR_A13
- DDR_D6 | DDR_A14
- DDR_D7 | DDR_A15
- DDR_D8 | DDR_BA0
- DDR_D9 | DDR_BA1
- DDR_D10 | DDR_BA2
- DDR_D11
- DDR_D12 | DDR_ODT
- DDR_ODT
- DDR_D13
- DDR_D14
- VDDS_DDR
- DDR_D15
- DDR_DQS1
- DDR_DQSN1
- DDR_DQS0
- DDR_DQSN0
- DDR_DQM1
- DDR_DQM0
- VDDS_DDR
- VDDS_DDR
- DGND | DGND
- VDDS_DDR
- DDR_VREF
- VDDS_DDR
- ZQ
- DGND
- 4Gb DDR3 | DGND
- DGND | DGND

## Sheet 8 of 11
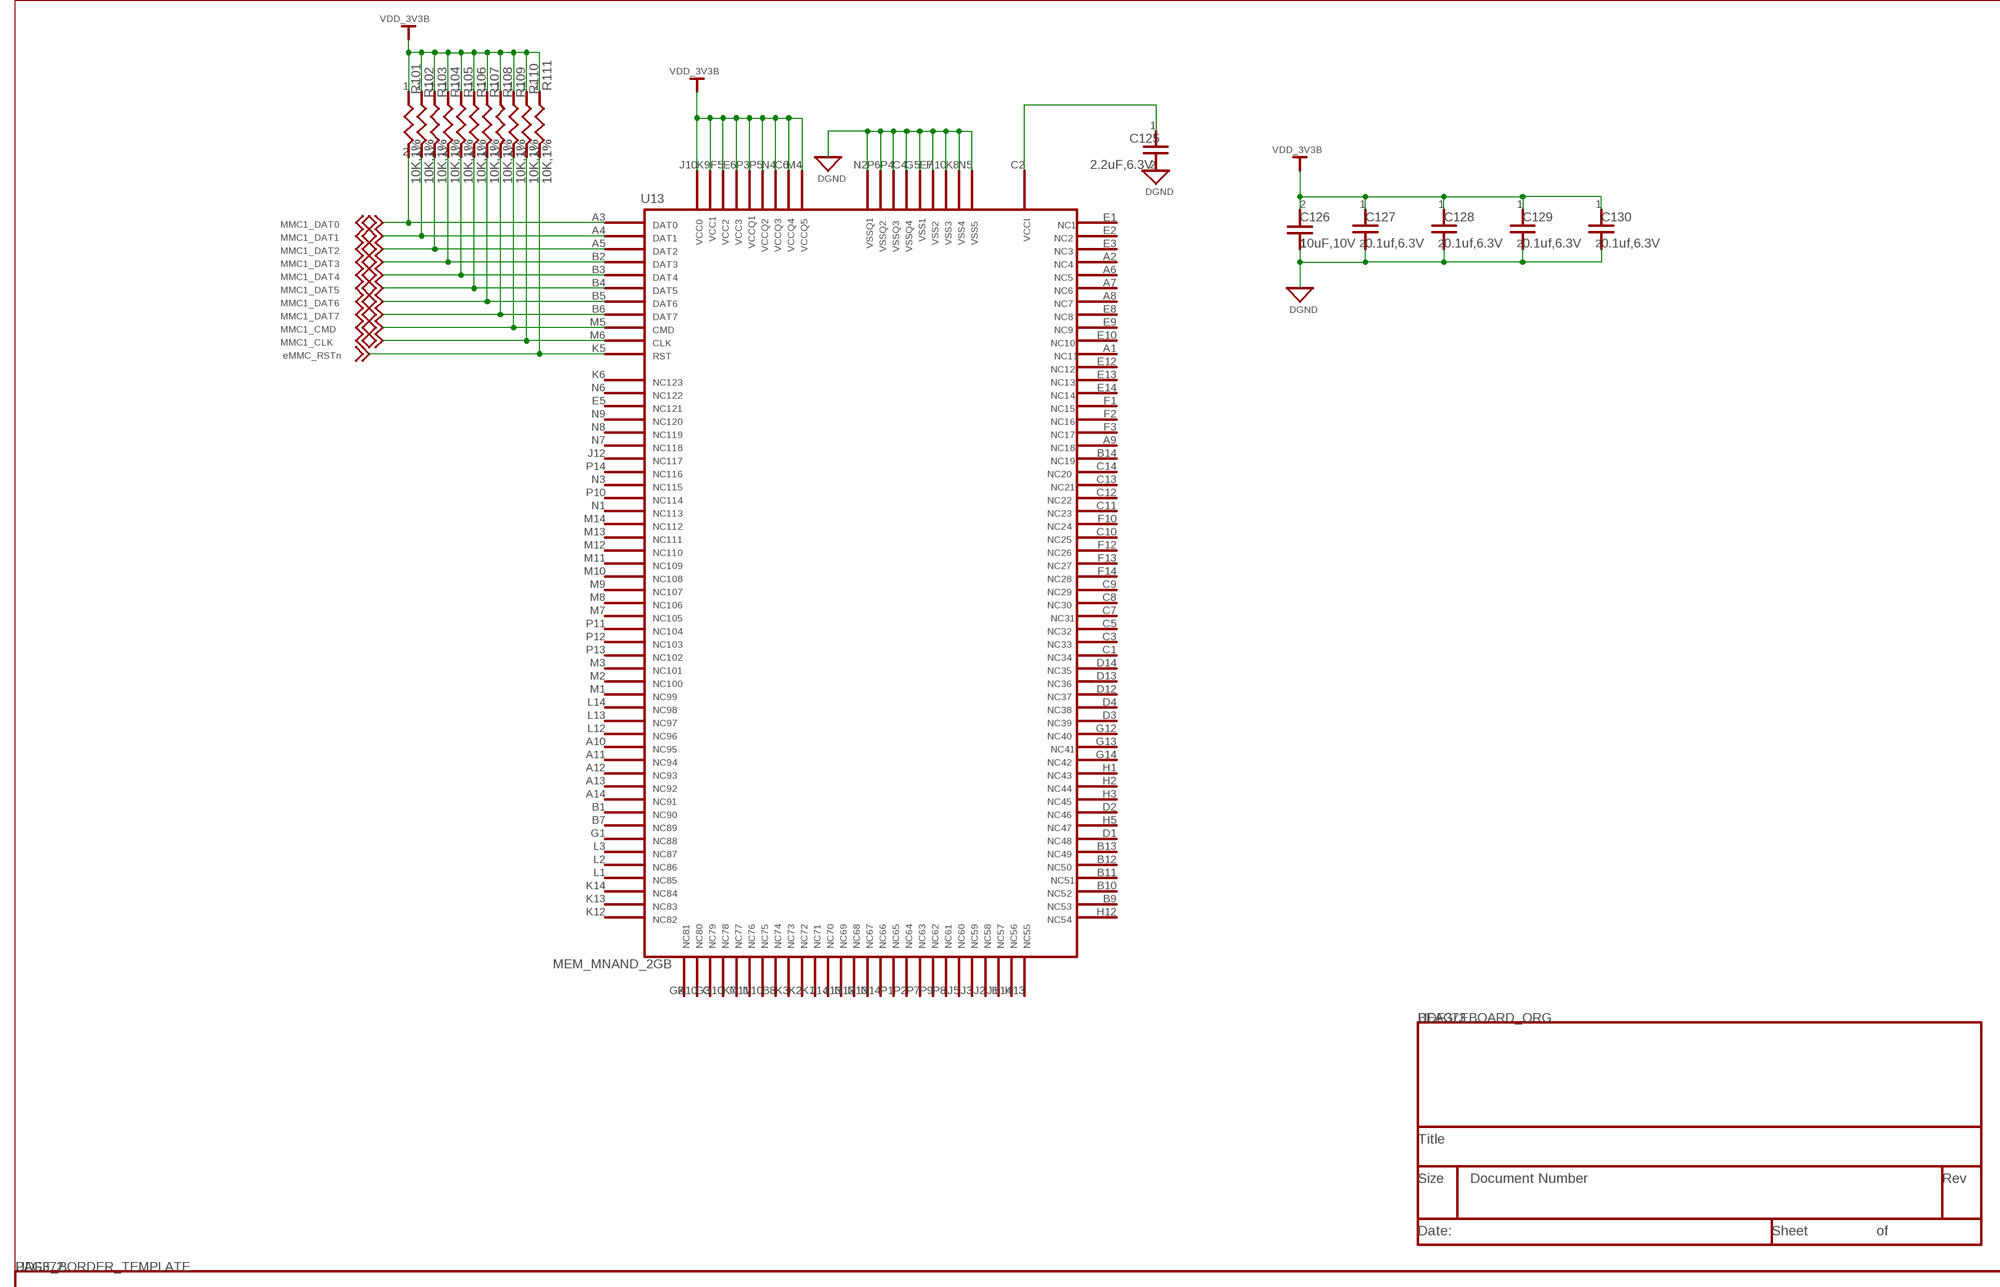
[diagram p10: schematic, sheet 8]

### Parts
C125  2.2uF,6.3V  CAP_2.2UF_X5R_6.3V_10%_0402_402  [402]
C126  10uF,10V  CAP_10UF_Y5V_10V_10%_0805_805_1  [805]
C127  0.1uf,6.3V  CAP_0.1UF_X5R_6.3V_20%_0201__40  [402]
C128  0.1uf,6.3V  CAP_0.1UF_X5R_6.3V_20%_0201__40  [402]
C129  0.1uf,6.3V  CAP_0.1UF_X5R_6.3V_20%_0201__40  [402]
C130  0.1uf,6.3V  CAP_0.1UF_X5R_6.3V_20%_0201__40  [402]
R101  10K,1%  RES_10K_1/16W_1%_0402_402_10K_1  [402]
R102  10K,1%  RES_10K_1/16W_1%_0402_402_10K_1  [402]
R103  10K,1%  RES_10K_1/16W_1%_0402_402_10K_1  [402]
R104  10K,1%  RES_10K_1/16W_1%_0402_402_10K_1  [402]
R105  10K,1%  RES_10K_1/16W_1%_0402_402_10K_1  [402]
R106  10K,1%  RES_10K_1/16W_1%_0402_402_10K_1  [402]
R107  10K,1%  RES_10K_1/16W_1%_0402_402_10K_1  [402]
R108  10K,1%  RES_10K_1/16W_1%_0402_402_10K_1  [402]
R109  10K,1%  RES_10K_1/16W_1%_0402_402_10K_1  [402]
R110  10K,1%  RES_10K_1/16W_1%_0402_402_10K_1  [402]
R111  10K,1%  RES_10K_1/16W_1%_0402_402_10K_1  [402]
U13  MEM_MNAND_2GB  MEM_MNAND_2GB_BGA153_P14_P5_11P  [BGA153_P14_P5_11P5X13]

### Nets
DGND: C125.2 C126.1 C127.2 C128.2 C129.2 C130.2 U13.C4 U13.E7 U13.G5 U13.H10 U13.K8 U13.N2 U13.N5 U13.P4 U13.P6 ; supply symbol labelled GND_SIGNAL_DGND ; also sheet 2,3,4,5,6,7,9,10,11
EMMC_RSTN: R111.2 U13.K5 ; also sheet 3
EMMC_VCCI: C125.1 U13.C2
MMC1_CLK: R110.2 U13.M6 ; also sheet 3,11
MMC1_CMD: R109.2 U13.M5 ; also sheet 3,11
MMC1_DAT0: R101.2 U13.A3 ; also sheet 3,11
MMC1_DAT1: R102.2 U13.A4 ; also sheet 3,11
MMC1_DAT2: R103.2 U13.A5 ; also sheet 3,11
MMC1_DAT3: R104.2 U13.B2 ; also sheet 3,11
MMC1_DAT4: R105.2 U13.B3 ; also sheet 3,11
MMC1_DAT5: R106.2 U13.B4 ; also sheet 3,11
MMC1_DAT6: R107.2 U13.B5 ; also sheet 3,11
MMC1_DAT7: R108.2 U13.B6 ; also sheet 3,11
VDD_3V3B: C126.2 C127.1 C128.1 C129.1 C130.1 R101.1 R102.1 R103.1 R104.1 R105.1 R106.1 R107.1 R108.1 R109.1 R110.1 R111.1 U13.C6 U13.E6 U13.F5 U13.J10 U13.K9 U13.M4 U13.N4 U13.P3 U13.P5 ; supply symbol labelled VCC_BAR_VDD_3V3B ; also sheet 2,3,4,9,10,11
Unconnected: U13.A1 U13.A2 U13.A6 U13.A7 U13.A8 U13.A9 U13.A10 U13.A11 U13.A12 U13.A13 U13.A14 U13.B1 U13.B7 U13.B8 U13.B9 U13.B10 U13.B11 U13.B12 U13.B13 U13.B14 U13.C1 U13.C3 U13.C5 U13.C7 U13.C8 U13.C9 U13.C10 U13.C11 U13.C12 U13.C13 U13.C14 U13.D1 U13.D2 U13.D3 U13.D4 U13.D12 U13.D13 U13.D14 U13.E1 U13.E2 U13.E3 U13.E5 U13.E8 U13.E9 U13.E10 U13.E12 U13.E13 U13.E14 U13.F1 U13.F2 U13.F3 U13.F10 U13.F12 U13.F13 U13.F14 U13.G1 U13.G2 U13.G3 U13.G10 U13.G12 U13.G13 U13.G14 U13.H1 U13.H2 U13.H3 U13.H5 U13.H12 U13.H13 U13.H14 U13.J1 U13.J2 U13.J3 U13.J5 U13.J12 U13.J13 U13.J14 U13.K1 U13.K2 U13.K3 U13.K6 U13.K7 U13.K10 U13.K12 U13.K13 U13.K14 U13.L1 U13.L2 U13.L3 U13.L12 U13.L13 U13.L14 U13.M1 U13.M2 U13.M3 U13.M7 U13.M8 U13.M9 U13.M10 U13.M11 U13.M12 U13.M13 U13.M14 U13.N1 U13.N3 U13.N6 U13.N7 U13.N8 U13.N9 U13.N10 U13.N11 U13.N12 U13.N13 U13.N14 U13.P1 U13.P2 U13.P7 U13.P8 U13.P9 U13.P10 U13.P11 U13.P12 U13.P13 U13.P14

### Notes on the sheet
- VDD_3V3B
- VDD_3V3B
- VDD_3V3B
- DGND
- DGND
- MMC1_DAT0
- MMC1_DAT1
- MMC1_DAT2
- MMC1_DAT3
- MMC1_DAT4
- MMC1_DAT5
- MMC1_DAT6
- DGND
- MMC1_DAT7
- MMC1_CMD
- MMC1_CLK
- eMMC_RSTn

## Sheet 9 of 11
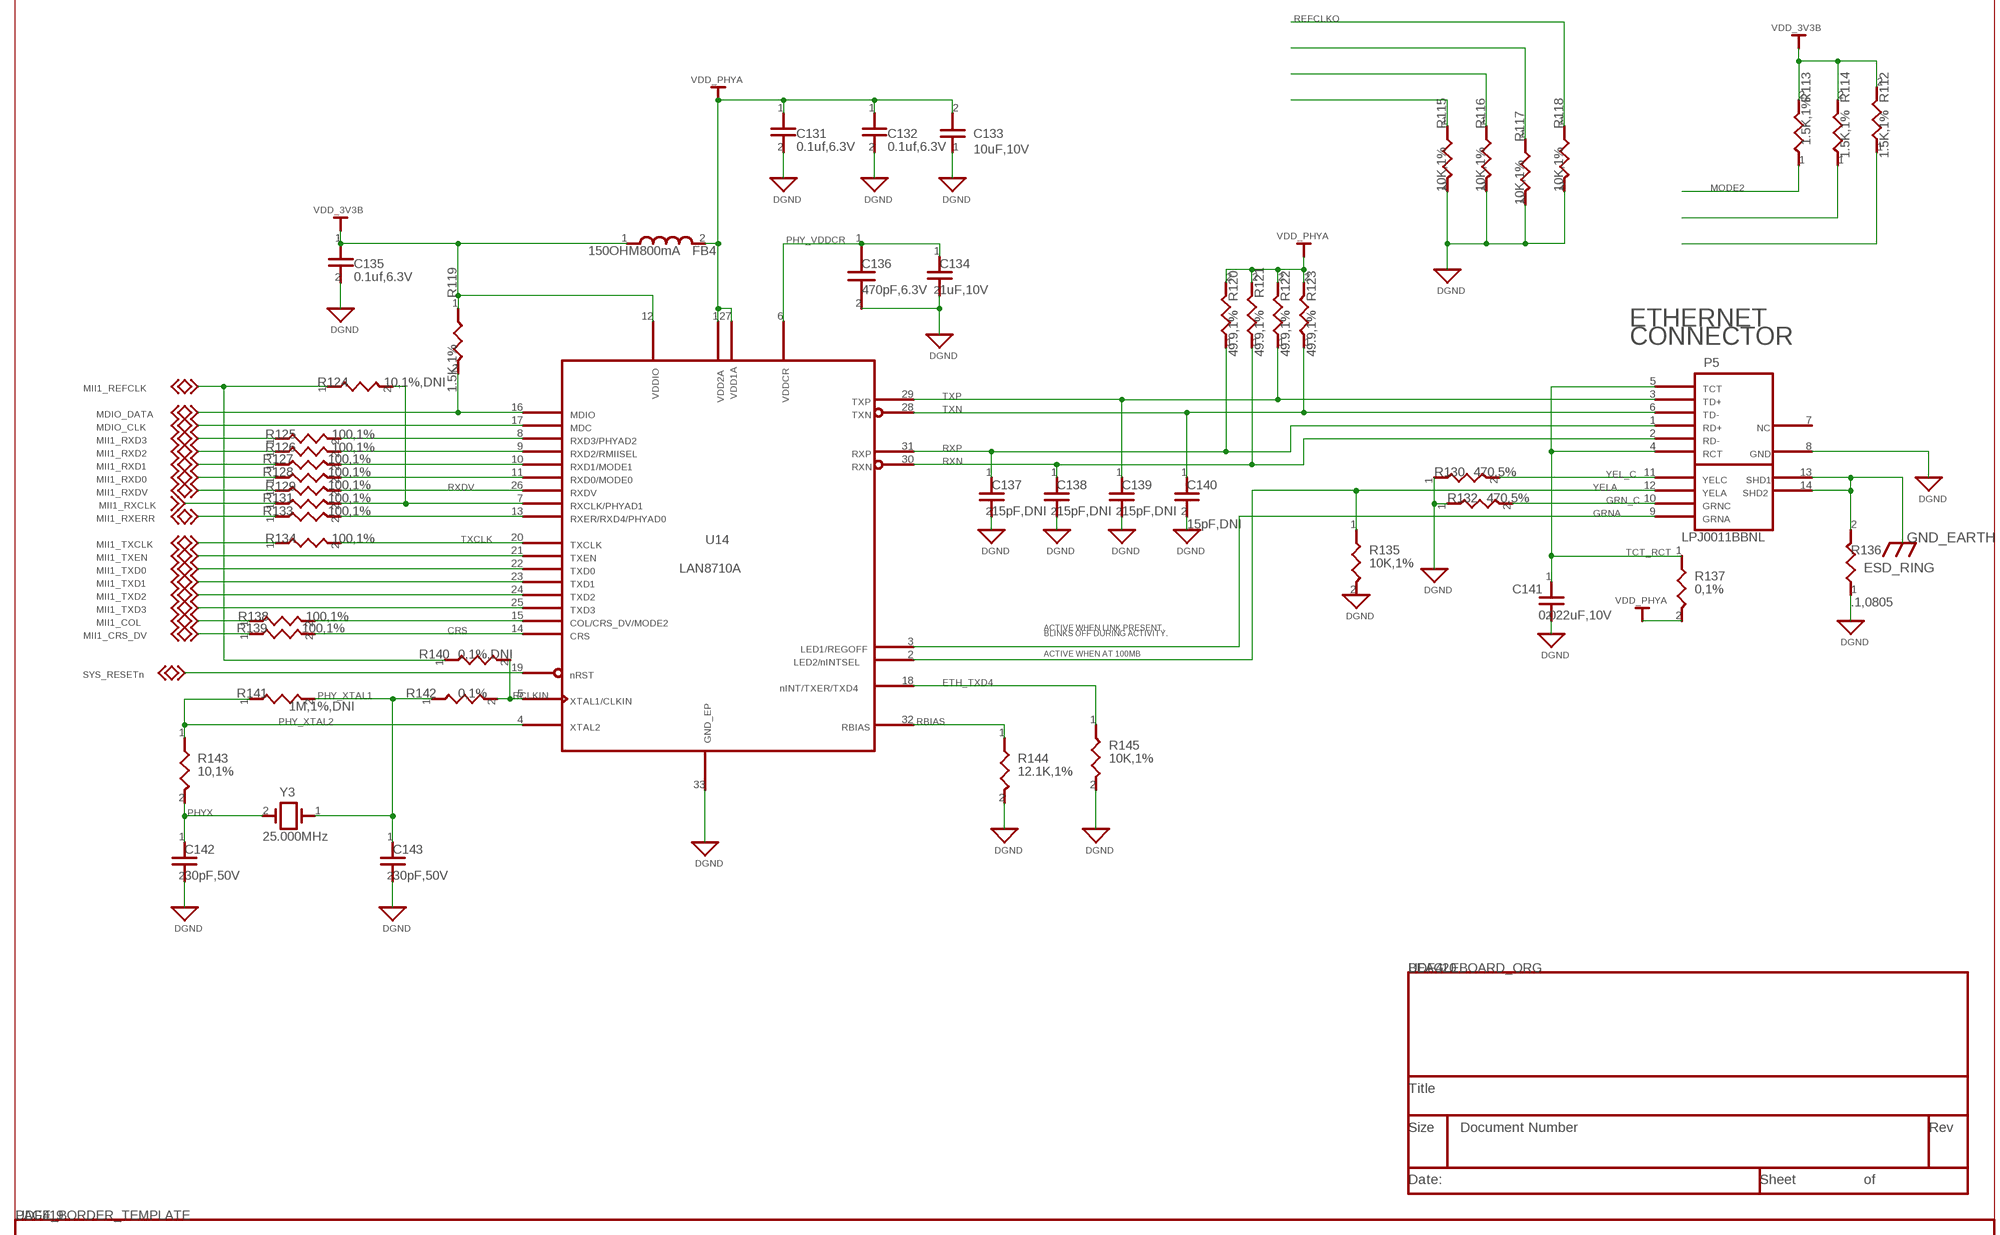
[diagram p11: schematic, sheet 9]

### Parts
C131  0.1uf,6.3V  CAP_0.1UF_X5R_6.3V_20%_0201__40  [402]
C132  0.1uf,6.3V  CAP_0.1UF_X5R_6.3V_20%_0201__40  [402]
C133  10uF,10V  CAP_10UF_Y5V_10V_10%_0805_805_1  [805]
C134  1uF,10V  CAP_1.0UF_X5R_10V_10%_0402_402_  [402]
C135  0.1uf,6.3V  CAP_0.1UF_X5R_6.3V_20%_0201__40  [402]
C136  470pF,6.3V  470PF/5%/50V/C0G/0603_0_0402_47  [0402]
C137  15pF,DNI  CAP_0402_100PF_COG_50V_402_15PF  [402]
C138  15pF,DNI  CAP_0402_100PF_COG_50V_402_15PF  [402]
C139  15pF,DNI  CAP_0402_100PF_COG_50V_402_15PF  [402]
C140  15pF,DNI  CAP_0402_100PF_COG_50V_402_15PF  [402]
C141  0.022uF,10V  CAP_0402_0.1UF_X5R_10V_402_0.02  [402]
C142  30pF,50V  CAP_30PF_COG_50V_5%_0402_402_30  [402]
C143  30pF,50V  CAP_30PF_COG_50V_5%_0402_402_30  [402]
FB4  150OHM800mA  FER_180_200_0_SM-7351-IND-0805_  [SM-7351-IND-0805]
P5  LPJ0011BBNL  CONN_RJ45_MAG_WE_0_RJ45-7499010  [RJ45-7499010211A]
R112  1.5K,1%  RES_4.75K_1/16W_1%_0402_402_1.5  [402]
R113  1.5K,1%  RES_4.75K_1/16W_1%_0402_402_1.5  [402]
R114  1.5K,1%  RES_4.75K_1/16W_1%_0402_402_1.5  [402]
R115  10K,1%  RES_4.75K_1/16W_1%_0402_402_10K  [402]
R116  10K,1%  RES_4.75K_1/16W_1%_0402_402_10K  [402]
R117  10K,1%  RES_4.75K_1/16W_1%_0402_402_10K  [402]
R118  10K,1%  RES_4.75K_1/16W_1%_0402_402_10K  [402]
R119  1.5K,1%  RES_1.5K_1/16W_5%_0402_402_1.5K  [402]
R120  49.9,1%  RES_4.7K_0402_402_49.9_1%  [402]
R121  49.9,1%  RES_4.7K_0402_402_49.9_1%  [402]
R122  49.9,1%  RES_4.7K_0402_402_49.9_1%  [402]
R123  49.9,1%  RES_4.7K_0402_402_49.9_1%  [402]
R124  10,1%,DNI  100-1/10W-1%-0603_4_402_10_1%_D  [402]
R125  100,1%  100-1/10W-1%-0603_4_402_100_1%  [402]
R126  100,1%  100-1/10W-1%-0603_4_402_100_1%  [402]
R127  100,1%  RES_100_1/10W_5%_0402_402_100_1  [402]
R128  100,1%  RES_100_1/10W_5%_0402_402_100_1  [402]
R129  100,1%  100-1/10W-1%-0603_4_402_100_1%  [402]
R130  470,5%  RES_470_1/10W_5%_0402_402_470_5  [402]
R131  100,1%  RES_100_1/10W_5%_0402_402_100_1  [402]
R132  470,5%  RES_470_1/10W_5%_0402_402_470_5  [402]
R133  100,1%  RES_100_1/10W_5%_0402_402_100_1  [402]
R134  100,1%  100-1/10W-1%-0603_4_402_100_1%  [402]
R135  10K,1%  RES_10K_1/16W_1%_0402_402_10K_1  [402]
R136  .1,0805  RES_0.1_0805_805_.1_0805  [805]
R137  0,1%  RES_10K_1/16W_1%_0402_402_0_1%  [402]
R138  100,1%  100-1/10W-1%-0603_4_402_100_1%  [402]
R139  100,1%  RES_100_1/10W_5%_0402_402_100_1  [402]
R140  0,1%,DNI  RES_0_1/16W_1%_0402_402_0_1%_DN  [402]
R141  1M,1%,DNI  RES_1M_1/16W_1%_0402_402_1M_1%_  [402]
R142  0,1%  RES_0_1/16W_1%_0402_402_0_1%  [402]
R143  10,1%  RES_10K_1/16W_1%_0402_402_10_1%  [402]
R144  12.1K,1%  RES_12.1K_1/16W_1%_0402_402_12.  [402]
R145  10K,1%  RES_10K_1/16W_1%_0402_402_10K_1  [402]
U14  LAN8710A  LAN8710_QFN32_1_QFN32_5X5MM_EP3  [QFN32_5X5MM_EP3P3MM]
Y3  25.000MHz  SUNTSU_ITEMP_25MHZ__0.005%_20PF  [XTAL150SMD_125X196]

### Nets
CRS: R139.2 U14.14
DGND: C131.2 C132.2 C133.1 C134.2 C135.2 C136.2 C137.2 C138.2 C139.2 C140.2 C141.2 C142.2 C143.2 P5.8 R115.2 R116.2 R117.2 R118.2 R130.1 R132.1 R135.2 R136.1 R144.2 R145.2 U14.33 ; supply symbol labelled GND_SIGNAL_DGND ; also sheet 2,3,4,5,6,7,8,10,11
ETH_TXD4: R145.1 U14.18
GND_EARTH: P5.13 P5.14 R136.2 ; supply symbol labelled GND_EARTH_GND_EARTH ; also sheet 2,4,10,11
GRN_C: P5.10 R132.2
GRNA: P5.9 U14.3
MDIO_CLK: U14.17 ; also sheet 4
MDIO_DATA: R119.2 U14.16 ; also sheet 4
MII1_COL: R138.1 ; also sheet 4
MII1_CRS_DV: R139.1 ; also sheet 4
MII1_REFCLK: R124.1 R140.1 ; also sheet 4
MII1_RXCLK: R131.1 ; also sheet 4
MII1_RXD0: R128.1 ; also sheet 4
MII1_RXD1: R127.1 ; also sheet 4
MII1_RXD2: R126.1 ; also sheet 4
MII1_RXD3: R125.1 ; also sheet 4
MII1_RXDV: R129.1 ; also sheet 4
MII1_RXERR: R133.1 ; also sheet 4
MII1_TXCLK: R134.1 ; also sheet 4
MII1_TXD0: U14.22 ; also sheet 4
MII1_TXD1: U14.23 ; also sheet 4
MII1_TXD2: U14.24 ; also sheet 4
MII1_TXD3: U14.25 ; also sheet 4
MII1_TXEN: U14.21 ; also sheet 4
MODE2: R113.1 R138.2 U14.15
PHY_VDDCR: C134.1 C136.1 U14.6
PHY_XTAL1: C143.1 R141.2 R142.1 Y3.1
PHY_XTAL2: R141.1 R143.1 U14.4
PHYX: C142.1 R143.2 Y3.2
RBIAS: R144.1 U14.32
RCLKIN: R140.2 R142.2 U14.5
REFCLKO: R118.1 R124.2 R131.2 U14.7
RXD0\MODE0\: R112.1 R128.2 U14.11
RXD1\MODE1\: R114.1 R127.2 U14.10
RXD2\RMIISEL\: R117.1 R126.2 U14.9
RXD3\PHYAD2\: R116.1 R125.2 U14.8
RXDV: R129.2 U14.26
RXER\PHYAD0\: R115.1 R133.2 U14.13
RXN: C138.1 P5.2 R121.1 U14.30
RXP: C137.1 P5.1 R120.1 U14.31
SYS_RESETN: U14.19 ; also sheet 3,11
TCT_RCT: C141.1 P5.4 P5.5 R137.1
TXCLK: R134.2 U14.20
TXN: C140.1 P5.6 R123.1 U14.28
TXP: C139.1 P5.3 R122.1 U14.29
VDD_3V3B: C135.1 FB4.1 R112.2 R113.2 R114.2 R119.1 U14.12 ; supply symbol labelled VCC_BAR_VDD_3V3B ; also sheet 2,3,4,8,10,11
VDD_PHYA: C131.1 C132.1 C133.2 FB4.2 R120.2 R121.2 R122.2 R123.2 R137.2 U14.1 U14.27 ; supply symbol labelled VCC_BAR_VDD_PHYA
YEL_C: P5.11 R130.2
YELA: P5.12 R135.1 U14.2
Unconnected: P5.7

### Notes on the sheet
- REFCLKO
- VDD_3V3B
- VDD_PHYA
- MODE2
- DGND | DGND | DGND
- VDD_3V3B
- VDD_PHYA
- PHY_VDDCR
- DGND
- ETHERNET
- DGND
- CONNECTOR
- DGND
- MII1_REFCLK
- TXP
- TXN
- MDIO_DATA
- MDIO_CLK
- MII1_RXD3
- RXP
- MII1_RXD2
- RXN
- MII1_RXD1
- YEL_C
- MII1_RXD0
- RXDV | YELA
- MII1_RXDV
- GRN_C | DGND
- MII1_RXCLK
- GRNA
- MII1_RXERR
- TXCLK | GND_EARTH
- MII1_TXCLK
- DGND | DGND | DGND | DGND | TCT_RCT
- MII1_TXEN
- MII1_TXD0 | ESD_RING
- MII1_TXD1
- DGND
- MII1_TXD2
- VDD_PHYA
- MII1_TXD3
- DGND
- MII1_COL
- ACTIVE WHEN LINK PRESENT.
- CRS
- BLINKS OFF DURING ACTIVITY.
- MII1_CRS_DV
- DGND
- ACTIVE WHEN AT 100MB | DGND
- SYS_RESETn
- ETH_TXD4
- PHY_XTAL1 | RCLKIN
- PHY_XTAL2 | RBIAS
- PHYX
- DGND | DGND
- DGND
- DGND | DGND